# Altium project Main Board.PrjPcb
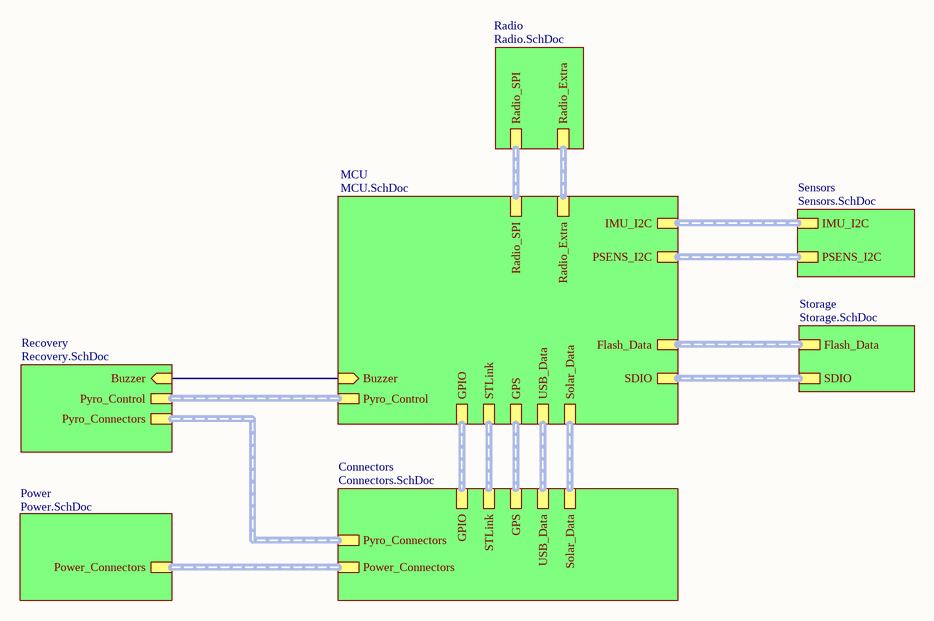
[diagram p0: Board Overview.SchDoc]
10 sheets, 127 parts. Net scope: hierarchical (ports join the sheet entries above them; power ports are global).
Board file: Main.PcbDoc
Sheets:
  Board Overview.SchDoc
    Power = Power.SchDoc
    MCU = MCU.SchDoc
    Storage = Storage.SchDoc
    Connectors = Connectors.SchDoc
    Radio = Radio.SchDoc
    Sensors = Sensors.SchDoc
    Recovery = Recovery.SchDoc
      P1 = Pyro.SchDoc
      P2 = Pyro.SchDoc
      Pyro Power = Pyro_Power.SchDoc

## Sheet Board Overview.SchDoc
size A4; SheetNumber: 1; SheetTotal: 10

### Sub-sheets
Connectors = Connectors.SchDoc: USB_Data (harness USB_Data), Pyro_Connectors (harness Pyro_Connectors), GPS (harness GPS), Power_Connectors (harness Power_Connectors), Solar_Data (harness Solar_Data), STLink (harness STLink), GPIO (harness GPIO)
MCU = MCU.SchDoc: USB_Data (harness USB_Data), Flash_Data (harness Flash_Data), SDIO (harness SDIO), PSENS_I2C (harness PSENS_I2C), IMU_I2C (harness IMU_I2C), Radio_SPI (harness Radio_SPI), Radio_Extra (harness Radio_extra), Pyro_Control (harness Pyro_Control), GPS (harness GPS), Buzzer (in), Solar_Data (harness Solar_Data), STLink (harness STLink), GPIO (harness GPIO)
Power = Power.SchDoc: Power_Connectors (harness Power_Connectors)
Radio = Radio.SchDoc: Radio_SPI (harness Radio_SPI), Radio_Extra (harness Radio_extra)
Recovery = Recovery.SchDoc: Pyro_Connectors (harness Pyro_Connectors), Pyro_Control (harness Pyro_Control), Buzzer (in)
Sensors = Sensors.SchDoc: IMU_I2C (harness IMU_I2C), PSENS_I2C (harness PSENS_I2C)
Storage = Storage.SchDoc: Flash_Data (harness Flash_Data), SDIO (harness SDIO)

### Nets
Buzzer: sheet MCU/Buzzer, sheet Recovery/Buzzer

### Buses and harness runs
harness sheet Connectors/GPIO = sheet MCU/GPIO
harness sheet Connectors/GPS = sheet MCU/GPS
harness sheet Connectors/Power_Connectors = sheet Power/Power_Connectors
harness sheet Connectors/Pyro_Connectors = sheet Recovery/Pyro_Connectors
harness sheet Connectors/Solar_Data = sheet MCU/Solar_Data
harness sheet Connectors/STLink = sheet MCU/STLink
harness sheet Connectors/USB_Data = sheet MCU/USB_Data
harness sheet MCU/Flash_Data = sheet Storage/Flash_Data
harness sheet MCU/IMU_I2C = sheet Sensors/IMU_I2C
harness sheet MCU/PSENS_I2C = sheet Sensors/PSENS_I2C
harness sheet MCU/Pyro_Control = sheet Recovery/Pyro_Control
harness sheet MCU/Radio_Extra = sheet Radio/Radio_Extra
harness sheet MCU/Radio_SPI = sheet Radio/Radio_SPI
harness sheet MCU/SDIO = sheet Storage/SDIO

## Sheet Power.SchDoc
size A4; SheetNumber: 6; SheetTotal: 10
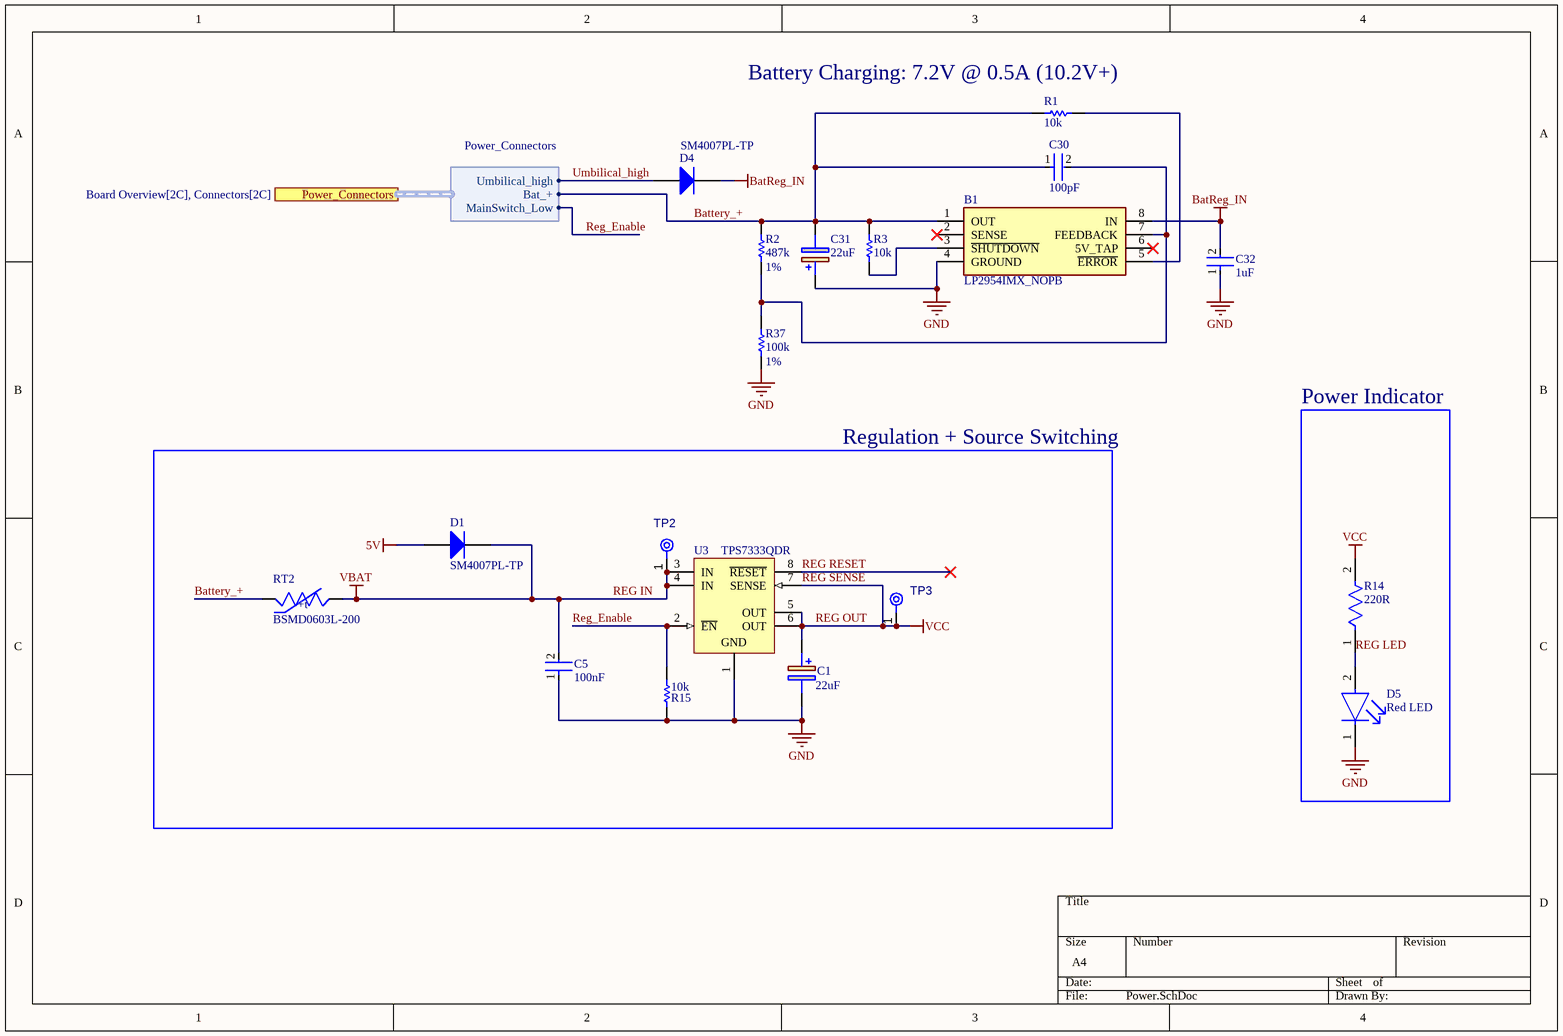
[diagram p1: Power.SchDoc]

### Parts
B1  LP2954IMX_NOPB  [SOIC127P600X175-8N]
C1  Capacitance: 22uF  [CAPPM3528X210N]  (hidden comment: TPSB226K010R0500)
C5  value 100nF  [FP-0603-L_1_6_0_15-W_0_81-IPC_C]  (hidden comment: Generic-Capacitor)
C30  value 100pF  [FP-0603-L_1_6_0_15-W_0_81-IPC_C]  (hidden comment: Generic-Capacitor)
C31  Capacitance: 22uF  [CAPPM3528X210N]  (hidden comment: TPSB226K010R0500)
C32  value 1uF  [FP-0603-L_1_6_0_15-W_0_81-IPC_C]  (hidden comment: Generic-Capacitor)
D1  SM4007PL-TP  [MCC-SOD-123FL_V]
D4  SM4007PL-TP  [MCC-SOD-123FL_V]
D5  Red LED  [FP-LTST-C190GKT-MFG]
R1  value 10k  [RESC1609X50X30ML8T20]  (hidden comment: Generic-Resistor)
R2  value 487k  Tolerance: 1%  [RESC1609X50X30ML8T20]  (hidden comment: Generic-Resistor)
R3  value 10k  [RESC1609X50X30ML8T20]  (hidden comment: Generic-Resistor)
R14  220R  [FP-CRCW0603-e3-IPC_C]
R15  10k  [RESC1608X55X25ML10T15]
R37  value 100k  Tolerance: 1%  [RESC1609X50X30ML8T20]  (hidden comment: Generic-Resistor)
RT2  BSMD0603L-200  [THRMC1608X95N]
TP2  TPAD6R  [TP06R]  (value not drawn)  (no BOM)
TP3  TPAD6R  [TP06R]  (value not drawn)  (no BOM)
U3  TPS7333QDR  [D0008A_L]

### Blocks framed on the sheet
Power Indicator: D5 R14
Regulation + Source Switching: C1 C5 D1 R15 RT2 TP2 TP3 U3

### Ports
Power_Connectors (harness Power_Connectors, see Board Overview[2C], Connectors[2C])

### Harnesses
Power_Connectors: Bat_+, MainSwitch_Low, Umbilical_high

### Nets
5V: D1.1(A)
BatReg_IN: B1.8(IN) C32.2 D4.2(K)
GND: B1.4(GROUND) C1.2(-) C5.1 C31.1(+) C32.1 D5.1(C) R15.1 R37.2 U3.1(GND)
VBAT: C5.2 D1.2(K) RT2.2 TP2.1(TP) U3.3(IN) U3.4(IN)  [also labelled REG IN]
VCC: C1.1(+) R14.2 TP3.1(TP) U3.5(OUT) U3.6(OUT) U3.7(SENSE)  [also labelled REG OUT, REG SENSE]
Battery_+: B1.1(OUT) C30.1 C31.2(-) R1.1 R2.1 R3.2 RT2.1 ; port Power_Connectors.Bat_+  [project net Bat_+]
REG LED: D5.2(A) R14.1
REG RESET: U3.8(~{RESET})
Reg_Enable: R15.2 U3.2(~{EN}) ; port Power_Connectors.MainSwitch_Low  [project net MainSwitch_Low]
Umbilical_high: D4.1(A) ; port Power_Connectors.Umbilical_high
NetB1_3: B1.3(~{SHUTDOWN}) R3.1
NetB1_5: B1.5(~{ERROR}) R1.2
NetB1_7: B1.7(FEEDBACK) C30.2 R2.2 R37.1

Not connected (* = marked no-connect by the designer): B1 2(SENSE)* 6(5V_TAP)*

### Notes on the sheet
- (near R1) Battery Charging: 7.2V @ 0.5A (10.2V+)
- (in symbol CMP-038-000000-2) +t

### Library data of the parts
B1 = CMP-086-000000-1: 5V and Adjustable Micropower LDOs; Manufacturer_Part_Number: LP2954IMX/NOPB; Manufacturer_Name: Texas Instruments; Geometry.Height: 1.75mm; Mouser Part Number: 926-LP2954IMX/NOPB; Mouser Price/Stock: https://www.mouser.co.uk/ProductDetail/Texas-Instruments/LP2954IMX-NOPB?qs=7lkVKPoqpbZZvpkFdRlvsg%3D%3D; Design Item ID: LP2954IMX_NOPB; Datasheet Link: http://www.ti.com/lit/gpn/LP2954; Source: LP2954IMX_NOPB.SchLib; LCSC Part #: C7989
C1 C31 = CMP-054-000000-2: AVX Electrolytic Capacitor 22uF 10V dc Electrolytic Solid +/-10% Tolerance TPS Series; Geometry.Height: 2.1mm; Manufacturer_Name: AVX; Manufacturer_Part_Number: TPSB226K010R0500; LCSC Part #: C400102; Mouser Part Number: 581-TPSB226K010R0500; Source: TPSB226K010R0500.SchLib; Design Item ID: TPSB226K010R0500; Datasheet Link: https://componentsearchengine.com/Datasheets/1/TPSB226K010R0500.pdf; Mouser Price/Stock: https://www.mouser.com/Search/Refine.aspx?Keyword=581-TPSB226K010R0500
C5 C30 C32 = CMP-001-00088-6: Generic 0603 Capacitor; Dielectric: X7R; Voltage Rating: 50V; Tolerance: 10%; ESR: 0R; Case Code (Imperial): 0603
  C5: LCSC Part #: C14663
  C30: LCSC Part #: C14858
  C32: LCSC Part #: C15849
D1 D4 = CMP-004-00034-1: DIODE GEN PURP 1KV 1A SOD123FL; LCSC Part #: C64898
D5 = CMP-00026-00001-1: SZYY0603R; LCSC PART #: C434419
R1 R3 = CMP-009-00185-4: Generic 0603 Resistor; Power Rating: 100mW; Voltage Rating: 75V; Tolerance: 0%; Case Code (Metric): 1608; Case Code (Imperial): 0603; LCSC Part #: C25804
R2 R37 = CMP-009-00185-4: Generic 0603 Resistor; Power Rating: 100mW; Voltage Rating: 75V; Case Code (Metric): 1608; Case Code (Imperial): 0603
  R2: LCSC Part #: C2930107
  R37: LCSC Part #: C25803
R14 = 0603WAF220JT5E-2: Res Thick Film 0603 220 Ohm 1% 1/10W ±100ppm/°C Molded SMD SMD Paper T/R; Power Rating: 100mW; Voltage Rating: 75V; Resistance: 220R; Resistance Tolerance: 1%; LCSC Part #: C22962
R15 = CMP-009-00177-3: ±1% 1/10W Thick Film Resistors 75V ±100ppm/℃ -55℃~+155℃ 10kΩ 0603 Chip Resistor - Surface Mount ROHS; LCSC Part #: C25804; Value: 10k
RT2 = CMP-038-000000-2: PTC Resettable Fuse: 2A Hold, 4A Trip, 0603; Hold Current: 2A; Pin Count: 2; Component Type: Standard; Availability: Unavailable; MP: BSMD0603L-200; Package: 0603; Design Item ID: BSMD0603L-200; Trip Current: 4A; LCSC Part #: C2757930
TP2 TP3 = CMP-00028-00002-2: 0.6mm round; Pins: 1
U3 = CMP-019-00052-1: IC REG LDO 3.3V 0.5A 8SOIC; LCSC Part #: C23791

## Sheet MCU.SchDoc
size A3; SheetNumber: 7; SheetTotal: 10
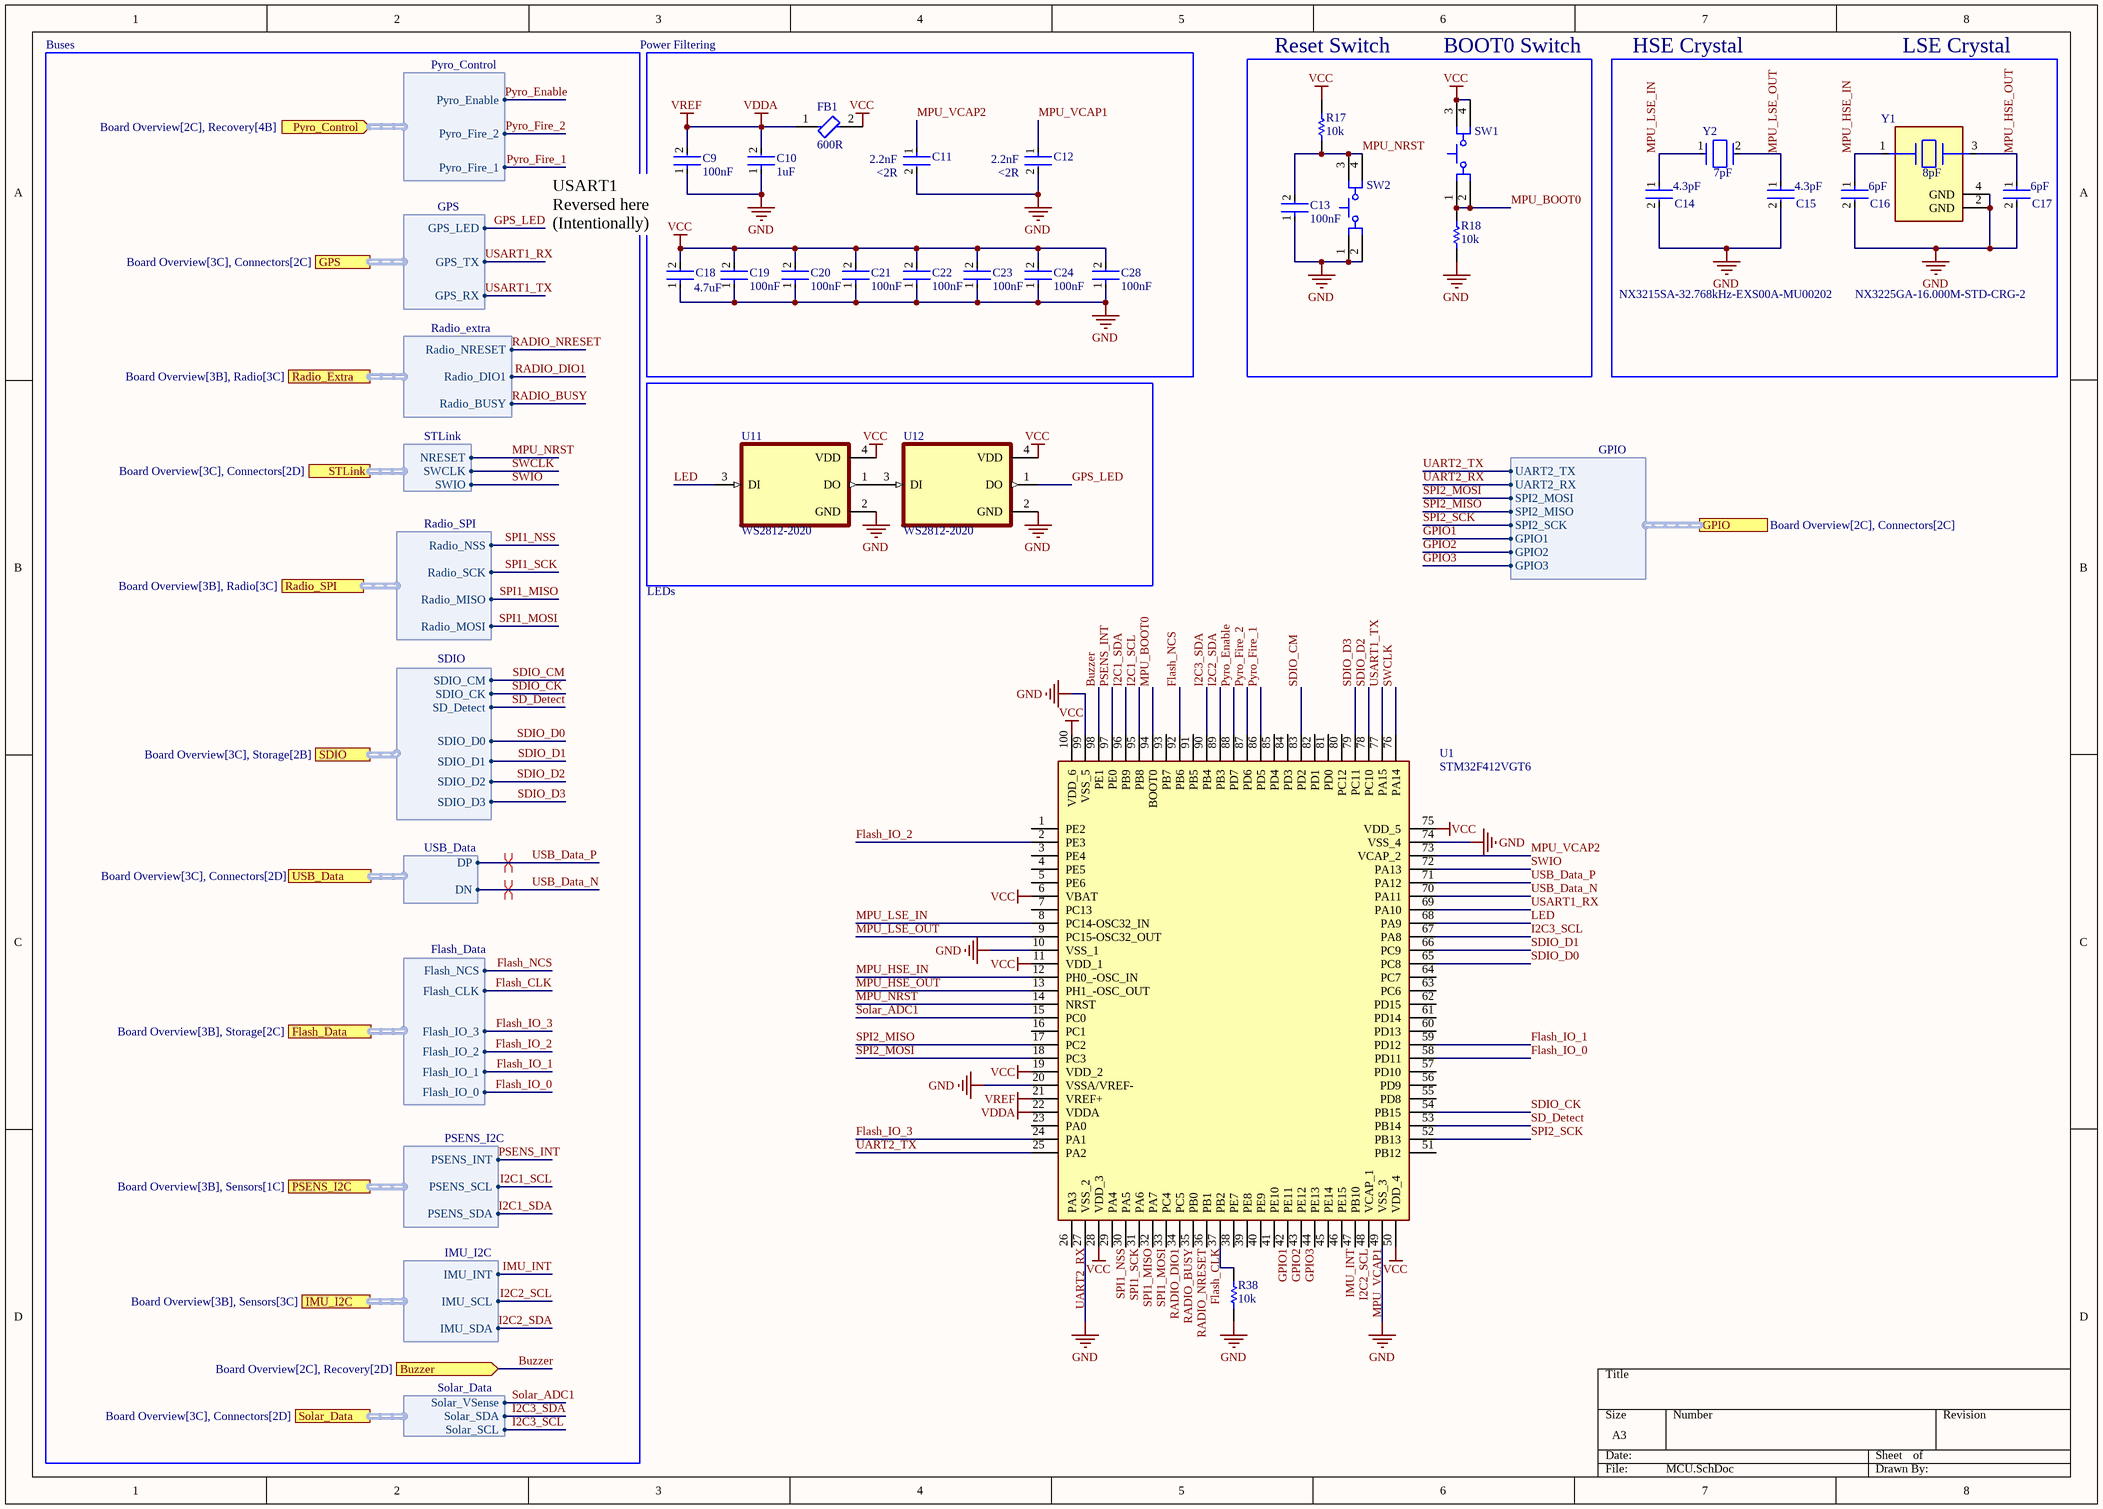
[diagram p2: MCU.SchDoc]

### Parts
C9  value 100nF  [FP-0603-L_1_6_0_15-W_0_81-IPC_C]  (hidden comment: Generic-Capacitor)
C10  value 1uF  [FP-0603-L_1_6_0_15-W_0_81-IPC_C]  (hidden comment: Generic-Capacitor)
C11  value 2.2nF  ESR: <2R  [FP-0603-L_1_6_0_15-W_0_81-IPC_C]  (hidden comment: Generic-Capacitor)
C12  value 2.2nF  ESR: <2R  [FP-0603-L_1_6_0_15-W_0_81-IPC_C]  (hidden comment: Generic-Capacitor)
C13  value 100nF  [FP-0603-L_1_6_0_15-W_0_81-IPC_C]  (hidden comment: Generic-Capacitor)
C14  value 4.3pF  [FP-CL10-IPC_B]  (hidden comment: 0603CG4R3C500NT)
C15  value 4.3pF  [FP-CL10-IPC_B]  (hidden comment: 0603CG4R3C500NT)
C16  value 6pF  [FP-CL10-IPC_B]  (hidden comment: CL10C060DB8NNNC)
C17  value 6pF  [FP-CL10-IPC_B]  (hidden comment: CL10C060DB8NNNC)
C18  value 4.7uF  [FP-0603-L_1_6_0_15-W_0_81-IPC_C]  (hidden comment: Generic-Capacitor)
C19  value 100nF  [FP-0603-L_1_6_0_15-W_0_81-IPC_C]  (hidden comment: Generic-Capacitor)
C20  value 100nF  [FP-0603-L_1_6_0_15-W_0_81-IPC_C]  (hidden comment: Generic-Capacitor)
C21  value 100nF  [FP-0603-L_1_6_0_15-W_0_81-IPC_C]  (hidden comment: Generic-Capacitor)
C22  value 100nF  [FP-0603-L_1_6_0_15-W_0_81-IPC_C]  (hidden comment: Generic-Capacitor)
C23  value 100nF  [FP-0603-L_1_6_0_15-W_0_81-IPC_C]  (hidden comment: Generic-Capacitor)
C24  value 100nF  [FP-0603-L_1_6_0_15-W_0_81-IPC_C]  (hidden comment: Generic-Capacitor)
C28  value 100nF  [FP-0603-L_1_6_0_15-W_0_81-IPC_C]  (hidden comment: Generic-Capacitor)
FB1  value 600R  [FP-BLM18-0_15-0_1-t0_6-IPC_B]  (hidden comment: GZ1608D601TF)
R17  value 10k  [RESC1608X55X25ML10T15]  (hidden comment: 0603WAF1002T5E)
R18  value 10k  [RESC1608X55X25ML10T15]  (hidden comment: 0603WAF1002T5E)
R38  value 10k  [RESC1609X50X30ML8T20]  (hidden comment: Generic-Resistor)
SW1  PTS645SM43SMTR92LFS  [CKCP-PTS645S_V]  (value not drawn)
SW2  PTS645SM43SMTR92LFS  [CKCP-PTS645S_V]  (value not drawn)
U1  STM32F412VGT6  [QFP50P1600X1600X160-100N]
U11  WS2812-2020  [LED_WS2812-2020]
U12  WS2812-2020  [LED_WS2812-2020]
Y1  NX3225GA-16.000M-STD-CRG-2  value 8pF  [FP-NX3225GA-MFG]
Y2  NX3215SA-32.768kHz-EXS00A-MU00202  value 7pF  [FP-NX3215SA-MFG]

### Ports
Buzzer (in, see Board Overview[2C], Recovery[2D]), Flash_Data (harness Flash_Data, see Board Overview[3B], Storage[2C]), GPIO (harness GPIO, see Board Overview[2C], Connectors[2C]), GPS (harness GPS, see Board Overview[3C], Connectors[2C]), IMU_I2C (harness IMU_I2C, see Board Overview[3B], Sensors[3C]), PSENS_I2C (harness PSENS_I2C, see Board Overview[3B], Sensors[1C]), Pyro_Control (in, harness Pyro_Control, see Board Overview[2C], Recovery[4B]), Radio_Extra (harness Radio_extra, see Board Overview[3B], Radio[3C]), Radio_SPI (harness Radio_SPI, see Board Overview[3B], Radio[3C]), SDIO (harness SDIO, see Board Overview[3C], Storage[2B]), Solar_Data (harness Solar_Data, see Board Overview[3C], Connectors[2D]), STLink (harness STLink, see Board Overview[3C], Connectors[2D]), USB_Data (harness USB_Data, see Board Overview[3C], Connectors[2D])

### Harnesses
USB_Data: DN, DP
Flash_Data: Flash_CLK, Flash_IO_0, Flash_IO_1, Flash_IO_2, Flash_IO_3, Flash_NCS
PSENS_I2C: PSENS_INT, PSENS_SCL, PSENS_SDA
IMU_I2C: IMU_INT, IMU_SCL, IMU_SDA
Radio_SPI: Radio_MOSI, Radio_MISO, Radio_SCK, Radio_NSS
Radio_extra: Radio_BUSY, Radio_DIO1, Radio_NRESET
Pyro_Control: Pyro_Fire_1, Pyro_Enable, Pyro_Fire_2
GPS: GPS_RX, GPS_TX, GPS_LED
SDIO: SDIO_CK, SDIO_CM, SDIO_D0, SDIO_D1, SDIO_D2, SDIO_D3, SD_Detect
Solar_Data: Solar_SCL, Solar_SDA, Solar_VSense
STLink: SWIO, SWCLK, NRESET
GPIO: UART2_TX, UART2_RX, SPI2_MOSI, SPI2_MISO, SPI2_SCK, GPIO1, GPIO2, GPIO3

### Nets
GND: C9.1 C10.1 C11.2 C12.2 C13.1 C14.2 C15.2 C16.2 C17.2 C18.1 C19.1 C20.1 C21.1 C22.1 C23.1 C24.1 C28.1 R18.1 R38.1 SW2.1 SW2.2 U1.10(VSS_1) U1.20(VSSA/VREF-) U1.27(VSS_2) U1.49(VSS_3) U1.74(VSS_4) U1.99(VSS_5) U11.2(GND) U12.2(GND) Y1.2(GND) Y1.4(GND)
VCC: C18.2 C19.2 C20.2 C21.2 C22.2 C23.2 C24.2 C28.2 FB1.2 R17.2 SW1.3 SW1.4 U1.6(VBAT) U1.11(VDD_1) U1.19(VDD_2) U1.28(VDD_3) U1.50(VDD_4) U1.75(VDD_5) U1.100(VDD_6) U11.4(VDD) U12.4(VDD)
VDDA: C9.2 C10.2 FB1.1 U1.21(VREF+) U1.22(VDDA)  [also labelled VREF]
Buzzer: U1.98(PE1) ; port Buzzer
Flash_CLK: U1.36(PB1) ; port Flash_Data.Flash_CLK  [project net Flash CLK]
Flash_IO_0: U1.58(PD11) ; port Flash_Data.Flash_IO_0  [project net Flash IO 0]
Flash_IO_1: U1.59(PD12) ; port Flash_Data.Flash_IO_1  [project net Flash IO 1]
Flash_IO_2: U1.2(PE3) ; port Flash_Data.Flash_IO_2  [project net Flash IO 2]
Flash_IO_3: U1.24(PA1) ; port Flash_Data.Flash_IO_3  [project net Flash IO 3]
Flash_NCS: U1.92(PB6) ; port Flash_Data.Flash_NCS  [project net Flash NCS]
GPIO1: U1.41(PE10) ; port GPIO.GPIO1
GPIO2: U1.42(PE11) ; port GPIO.GPIO2
GPIO3: U1.43(PE12) ; port GPIO.GPIO3
GPS_LED: U12.1(DO) ; port GPS.GPS_LED
I2C1_SCL: U1.95(PB8) ; port PSENS_I2C.PSENS_SCL
I2C1_SDA: U1.96(PB9) ; port PSENS_I2C.PSENS_SDA
I2C2_SCL: U1.47(PB10) ; port IMU_I2C.IMU_SCL
I2C2_SDA: U1.89(PB3) ; port IMU_I2C.IMU_SDA
I2C3_SCL: U1.67(PA8) ; port Solar_Data.Solar_SCL
I2C3_SDA: U1.90(PB4) ; port Solar_Data.Solar_SDA
IMU_INT: U1.46(PE15) ; port IMU_I2C.IMU_INT
LED: U1.68(PA9) U11.3(DI)
MPU_BOOT0: R18.2 SW1.1 SW1.2 U1.94(BOOT0)
MPU_HSE_IN: C16.1 U1.12(PH0_-OSC_IN) Y1.1
MPU_HSE_OUT: C17.1 U1.13(PH1_-OSC_OUT) Y1.3
MPU_LSE_IN: C14.1 U1.8(PC14-OSC32_IN) Y2.1
MPU_LSE_OUT: C15.1 U1.9(PC15-OSC32_OUT) Y2.2
MPU_NRST: C13.2 R17.1 SW2.3 SW2.4 U1.14(NRST) ; port STLink.NRESET
MPU_VCAP1: C12.1 U1.48(VCAP_1)
MPU_VCAP2: C11.1 U1.73(VCAP_2)
PSENS_INT: U1.97(PE0) ; port PSENS_I2C.PSENS_INT
Pyro_Enable: U1.88(PD7) ; port Pyro_Control.Pyro_Enable
Pyro_Fire_1: U1.86(PD5) ; port Pyro_Control.Pyro_Fire_1
Pyro_Fire_2: U1.87(PD6) ; port Pyro_Control.Pyro_Fire_2
RADIO_BUSY: U1.34(PC5) ; port Radio_Extra.Radio_BUSY  [project net BUSY]
RADIO_DIO1: U1.33(PC4) ; port Radio_Extra.Radio_DIO1  [project net DIO1]
RADIO_NRESET: U1.35(PB0) ; port Radio_Extra.Radio_NRESET  [project net NRESET]
SD_Detect: U1.53(PB14) ; port SDIO.SD_Detect
SDIO_CK: U1.54(PB15) ; port SDIO.SDIO_CK
SDIO_CM: U1.83(PD2) ; port SDIO.SDIO_CM
SDIO_D0: U1.65(PC8) ; port SDIO.SDIO_D0
SDIO_D1: U1.66(PC9) ; port SDIO.SDIO_D1
SDIO_D2: U1.78(PC10) ; port SDIO.SDIO_D2
SDIO_D3: U1.79(PC11) ; port SDIO.SDIO_D3
Solar_ADC1: U1.15(PC0) ; port Solar_Data.Solar_VSense
SPI1_MISO: U1.31(PA6) ; port Radio_SPI.Radio_MISO  [project net MISO]
SPI1_MOSI: U1.32(PA7) ; port Radio_SPI.Radio_MOSI  [project net MOSI]
SPI1_NSS: U1.29(PA4) ; port Radio_SPI.Radio_NSS  [project net NSS]
SPI1_SCK: U1.30(PA5) ; port Radio_SPI.Radio_SCK  [project net SCK]
SPI2_MISO: U1.17(PC2) ; port GPIO.SPI2_MISO
SPI2_MOSI: U1.18(PC3) ; port GPIO.SPI2_MOSI
SPI2_SCK: U1.52(PB13) ; port GPIO.SPI2_SCK
SWCLK: U1.76(PA14) ; port STLink.SWCLK
SWIO: U1.72(PA13) ; port STLink.SWIO
UART2_RX: U1.26(PA3) ; port GPIO.UART2_RX
UART2_TX: U1.25(PA2) ; port GPIO.UART2_TX
USART1_RX: U1.69(PA10) ; port GPS.GPS_TX  [project net GPS_TX]
USART1_TX: U1.77(PA15) ; port GPS.GPS_RX  [project net GPS_RX]
USB_Data_N: U1.70(PA11) ; port USB_Data.DN
USB_Data_P: U1.71(PA12) ; port USB_Data.DP
NetR38_2: R38.2 U1.37(PB2)
NetU11_1: U11.1(DO) U12.3(DI)

Not connected (* = marked no-connect by the designer): U1 1(PE2) 3(PE4) 4(PE5) 5(PE6) 7(PC13) 16(PC1) 23(PA0) 38(PE7) 39(PE8) 40(PE9) 44(PE13) 45(PE14) 51(PB12) 55(PD8) 56(PD9) 57(PD10) 60(PD13) 61(PD14) 62(PD15) 63(PC6) 64(PC7) 80(PC12) 81(PD0) 82(PD1) 84(PD3) 85(PD4) 91(PB5) 93(PB7)

### Layout directives
differential pair: USB_Data_N, USB_Data_P

### Notes on the sheet
- Buses
- Power Filtering
- Reset Switch
- BOOT0 Switch
- HSE Crystal
- LSE Crystal
- USART1 Reversed here (Intentionally)
- LEDs

### Library data of the parts
C9 = CMP-001-00088-6: Generic 0603 Capacitor; Tolerance: 10%; Dielectric: X7R; ESR: 0R; Voltage Rating: 50V; Case Code (Imperial): 0603; LCSC Part #: C14663
C10 C13 C18-C24 C28 = CMP-001-00088-6: as C5 on sheet Power; Case Code (Imperial): 0603
  C10: LCSC Part #: C15849
  C13 C19-C24 C28: LCSC Part #: C14663
  C18: LCSC Part #: C53987
C11 C12 = CMP-001-00088-6: Generic 0603 Capacitor; Dielectric: X7R; Voltage Rating: 50V; Tolerance: 10%; LCSC Part #: C1604; Case Code (Imperial): 0603
C14 C15 = CMP-001-00086-2: 50V 4.3pF C0G ±0.25pF 0603 Multilayer Ceramic Capacitors MLCC - SMD/SMT ROHS; LCSC PART #: C59526
C16 C17 = CMP-001-00087-1: CAP CER 6PF 50V C0G/NP0 0603; LCSC PART #: C37474
FB1 = CMP-006-00021-1: 0603 600Ω ±25% DCR=0.45Ω 0.2A; LCSC PART #: C1002
R17 R18 = CMP-009-00177-3: as R15 on sheet Power; LCSC Part #: C25804
R38 = CMP-009-00185-4: Generic 0603 Resistor; Power Rating: 100mW; Tolerance: 0%; Voltage Rating: 75V; Case Code (Metric): 1608; Case Code (Imperial): 0603; LCSC Part #: C25804
SW1 SW2 = CMP-011-00016-1: Switch Tactile N.O. SPST Round Button Gull Wing 0.05A 12VDC 100000Cycles 1.57N SMD T/R; LCSC PART #: C221880
U1 = CMP-028-000000-1: STMICROELECTRONICS - STM32F412VGT6 - ARM MCU, STM32 Family STM32F4 Series Microcontrollers, ARM Cortex-M4F, 32bit, 100 MHz, 1 MB, 256 KB; Geometry.Height: 1.6mm; Manufacturer_Part_Number: STM32F412VGT6; Manufacturer_Name: STMicroelectronics; Mouser Price/Stock: https://www.mouser.co.uk/ProductDetail/STMicroelectronics/STM32F412VGT6/?qs=qzCNEk%252BRr%252BaGf9Ry5zWpvw%3D%3D; Design Item ID: STM32F412VGT6; Mouser Part Number: 511-STM32F412VGT6; Datasheet Link: https://4donline.ihs.com/images/VipMasterIC/IC/SGST/SGST-S-A0004202317/SGST-S-A0004202317-1.pdf?hkey=6D3A4C79FDBF58556ACFDE234799DDF0; Source: STM32F412VGT6.SchLib; Package: 100-LQFP; LCSC Part #: C727951
U11 U12 = CMP-002-000000-1: Intelligent control LED light source, SMD-4; MF: Worldsemi; Value: *; Pin Count: 4; Check_prices: https://www.snapeda.com/parts/WS2812-2020/Worldsemi/view-part/?ref=eda; Package: Package; SnapEDA_Link: https://www.snapeda.com/parts/WS2812-2020/Worldsemi/view-part/?ref=snap; Price: None; MP: WS2812-2020; Availability: Not in stock; Design Item ID: WS2812-2020; Source: WS2812-2020.SchLib; Component Type: Standard; LCSC Part #: C965555
Y1 = CMP-003-00030-1: Crystal 16MHz ±20ppm (Tol) ±30ppm (Stability) 8pF FUND 80Ohm Automotive 4-Pin SMD; LCSC PART #: C156247
Y2 = CMP-003-00031-1: Crystal 32.7680KHZ 7PF SMD; LCSC PART #: C280830

## Sheet Storage.SchDoc
size A4; SheetNumber: 8; SheetTotal: 10
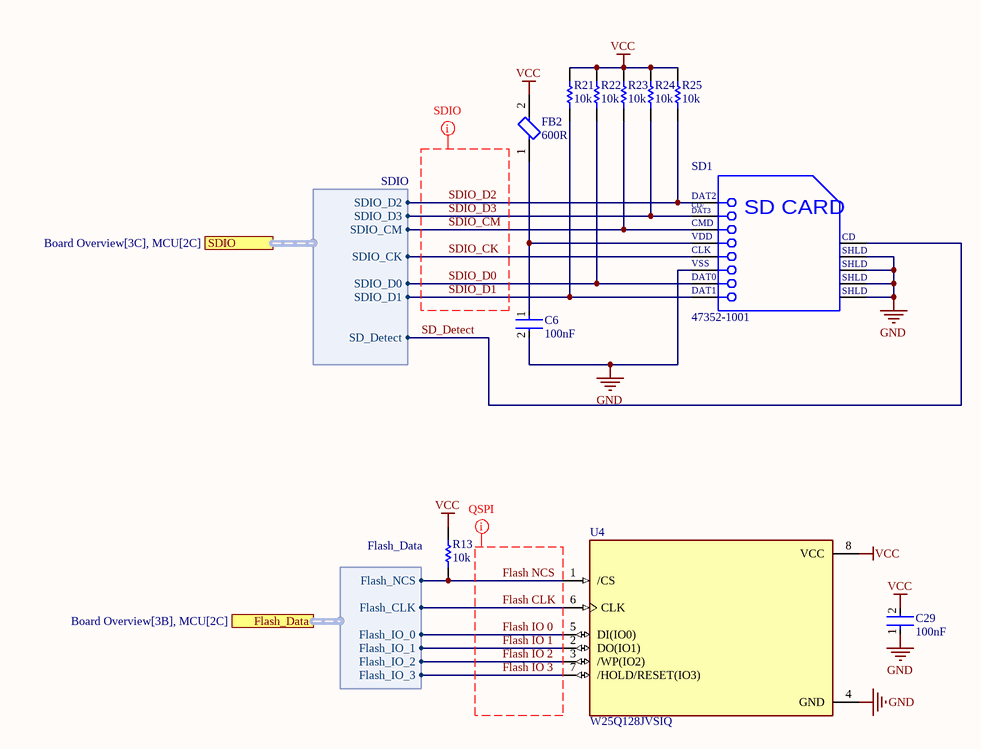
[diagram p3: Storage.SchDoc]

### Parts
C6  value 100nF  [FP-0603-L_1_6_0_15-W_0_81-IPC_C]  (hidden comment: Generic-Capacitor)
C29  value 100nF  [FP-0603-L_1_6_0_15-W_0_81-IPC_C]  (hidden comment: Generic-Capacitor)
FB2  value 600R  [FP-BLM18-0_15-0_1-t0_6-IPC_B]  (hidden comment: GZ1608D601TF)
R13  value 10k  [RESC1609X50X30ML8T20]  (hidden comment: Generic-Resistor)
R21  value 10k  [RESC1609X50X30ML8T20]  (hidden comment: Generic-Resistor)
R22  value 10k  [RESC1609X50X30ML8T20]  (hidden comment: Generic-Resistor)
R23  value 10k  [RESC1609X50X30ML8T20]  (hidden comment: Generic-Resistor)
R24  value 10k  [RESC1609X50X30ML8T20]  (hidden comment: Generic-Resistor)
R25  value 10k  [RESC1609X50X30ML8T20]  (hidden comment: Generic-Resistor)
SD1  47352-1001  [MOLX-473521001_V]
U4  W25Q128JVSIQ  [SOIC127P790X216-8N]

### Ports
Flash_Data (harness Flash_Data, see Board Overview[3B], MCU[2C]), SDIO (harness SDIO, see Board Overview[3C], MCU[2C])

### Harnesses
Flash_Data: Flash_NCS, Flash_CLK, Flash_IO_0, Flash_IO_1, Flash_IO_2, Flash_IO_3
SDIO: SDIO_D2, SDIO_D3, SDIO_CM, SDIO_CK, SDIO_D0, SDIO_D1, SD_Detect

### Nets
GND: C6.2 C29.1 SD1.6(VSS) SD1.10(SHLD) SD1.11(SHLD) SD1.12(SHLD) SD1.13(SHLD) U4.4(GND)
VCC: C29.2 FB2.2 R13.2 R21.2 R22.2 R23.2 R24.2 R25.2 U4.8(VCC)
Flash CLK: U4.6(CLK) ; port Flash_Data.Flash_CLK
Flash IO 0: U4.5(DI(IO0)) ; port Flash_Data.Flash_IO_0
Flash IO 1: U4.2(DO(IO1)) ; port Flash_Data.Flash_IO_1
Flash IO 2: U4.3(/WP(IO2)) ; port Flash_Data.Flash_IO_2
Flash IO 3: U4.7(/HOLD/RESET(IO3)) ; port Flash_Data.Flash_IO_3
Flash NCS: R13.1 U4.1(/CS) ; port Flash_Data.Flash_NCS
SD_Detect: SD1.9(CD) ; port SDIO.SD_Detect
SDIO_CK: SD1.5(CLK) ; port SDIO.SDIO_CK
SDIO_CM: R23.1 SD1.3(CMD) ; port SDIO.SDIO_CM
SDIO_D0: R22.1 SD1.7(DAT0) ; port SDIO.SDIO_D0
SDIO_D1: R21.1 SD1.8(DAT1) ; port SDIO.SDIO_D1
SDIO_D2: R25.1 SD1.1(DAT2) ; port SDIO.SDIO_D2
SDIO_D3: R24.1 SD1.2(CD/DAT3) ; port SDIO.SDIO_D3
NetC6_1: C6.1 FB2.1 SD1.4(VDD)

### Layout directives
mark named QSPI: Flash CLK, Flash IO 0, Flash IO 1, Flash IO 2, Flash IO 3, Flash NCS
mark named SDIO: SDIO_CK, SDIO_CM, SDIO_D0, SDIO_D1, SDIO_D2, SDIO_D3

### Notes on the sheet
- (in symbol CMP-002-00077-1) CD/; DAT3; SD CARD

### Library data of the parts
C6 C29 = CMP-001-00088-6: as C5 on sheet Power; LCSC Part #: C14663; Case Code (Imperial): 0603
FB2 = CMP-006-00021-1: 0603 600Ω ±25% DCR=0.45Ω 0.2A; LCSC PART #: C1002
R13 R21-R25 = CMP-009-00185-4: as R38 on sheet MCU; Case Code (Metric): 1608; Case Code (Imperial): 0603; LCSC Part #: C25804
SD1 = CMP-002-00077-1: Conn Micro SD Card HDR 8 POS 1.1mm Solder RA SMD Embossed T/R 0.5A/Contact; LCSC Part #: C293569
U4 = CMP-040-000000-2: FLASH - NOR Memory IC 128Mb (16M x 8) SPI - Quad I/O, QPI, DTR 133 MHz 8-SOIC; MF: Winbond Electronics; Capacity: 128Mb; Design Item ID: W25Q128JVSIQ; Pin Count: 8; MP: W25Q128JVSIQ; Price: None; Package: SOIC-8 Winbond; LCSC Part #: C97521

## Sheet Connectors.SchDoc
size A4; SheetNumber: 9; SheetTotal: 10
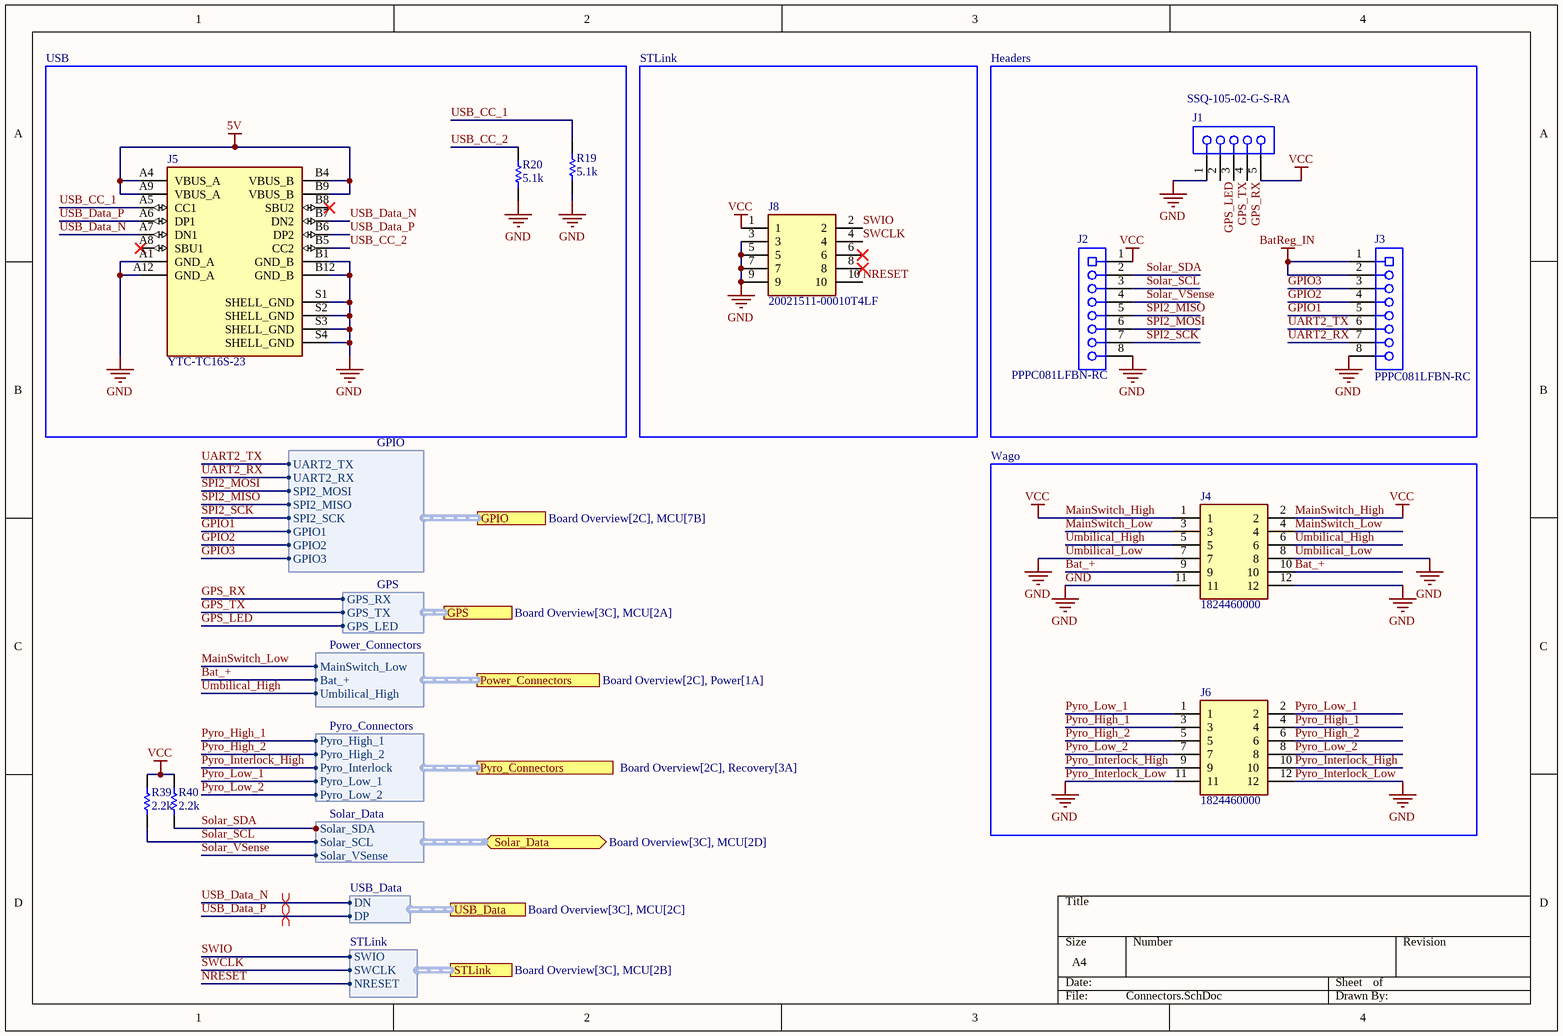
[diagram p4: Connectors.SchDoc]

### Parts
J1  SSQ-105-02-G-S-RA  [SMTC-SSQ-105-02-X-S-RA]
J2  PPPC081LFBN-RC  [SLIN-PPPC081LFBN-RC_V]
J3  PPPC081LFBN-RC  [SLIN-PPPC081LFBN-RC_V]
J4  1824460000  [SHDR12W80P700X350_2X6_2170X1400X850P]
J5  YTC-TC16S-23  [VALCON_CSP-USC16-TR]
J6  1824460000  [SHDR12W80P700X350_2X6_2170X1400X850P]
J8  20021511-00010T4LF  [2002151100010T4LF]
R19  value 5.1k  [RESC1609X50X30ML8T20]  (hidden comment: Generic-Resistor)
R20  value 5.1k  [RESC1609X50X30ML8T20]  (hidden comment: Generic-Resistor)
R39  value 2.2k  [RESC1609X50X30ML8T20]  (hidden comment: Generic-Resistor)
R40  value 2.2k  [RESC1609X50X30ML8T20]  (hidden comment: Generic-Resistor)

### Blocks framed on the sheet
USB: J5 R19 R20
STLink: J8
Headers: J1-J3
Wago: J4 J6

### Ports
GPIO (harness GPIO, see Board Overview[2C], MCU[7B]), GPS (harness GPS, see Board Overview[3C], MCU[2A]), Power_Connectors (harness Power_Connectors, see Board Overview[2C], Power[1A]), Pyro_Connectors (harness Pyro_Connectors, see Board Overview[2C], Recovery[3A]), Solar_Data (bidir, harness Solar_Data, see Board Overview[3C], MCU[2D]), STLink (harness STLink, see Board Overview[3C], MCU[2B]), USB_Data (harness USB_Data, see Board Overview[3C], MCU[2C])

### Harnesses
USB_Data: DP, DN
GPS: GPS_RX, GPS_TX, GPS_LED
Power_Connectors: Bat_+, MainSwitch_Low, Umbilical_High
Pyro_Connectors: Pyro_High_1, Pyro_High_2, Pyro_Interlock, Pyro_Low_1, Pyro_Low_2
Solar_Data: Solar_SCL, Solar_SDA, Solar_VSense
STLink: SWIO, SWCLK, NRESET
GPIO: UART2_TX, UART2_RX, SPI2_MOSI, SPI2_MISO, SPI2_SCK, GPIO1, GPIO2, GPIO3

### Nets
5V: J5.A4(VBUS_A) J5.A9(VBUS_A) J5.B4(VBUS_B) J5.B9(VBUS_B)
BatReg_IN: J3.1 J3.2
GND: J1.1 J2.8 J3.8 J4.7 J4.8 J4.11 J4.12 J5.A1(GND_A) J5.A12(GND_A) J5.B1(GND_B) J5.B12(GND_B) J5.S1(SHELL_GND) J5.S2(SHELL_GND) J5.S3(SHELL_GND) J5.S4(SHELL_GND) J6.11 J6.12 J8.3 J8.5 J8.7 J8.9 R19.2 R20.2  [also labelled Pyro_Interlock_Low, Umbilical_Low]
VCC: J1.5 J2.1 J4.1 J4.2 J8.1 R39.1 R40.1  [also labelled MainSwitch_High]
Bat_+: J4.9 J4.10 ; port Power_Connectors.Bat_+
GPIO1: J3.5 ; port GPIO.GPIO1
GPIO2: J3.4 ; port GPIO.GPIO2
GPIO3: J3.3 ; port GPIO.GPIO3
GPS_LED: J1.2 ; port GPS.GPS_LED
GPS_RX: J1.4 ; port GPS.GPS_RX
GPS_TX: J1.3 ; port GPS.GPS_TX
MainSwitch_Low: J4.3 J4.4 ; port Power_Connectors.MainSwitch_Low
NRESET: J8.10 ; port STLink.NRESET  [project net MPU_NRST]
Pyro_High_1: J6.3 J6.4 J6.5 J6.6 ; port Pyro_Connectors.Pyro_High_1, port Pyro_Connectors.Pyro_High_2  [also labelled Pyro_High_2]
Pyro_Interlock_High: J6.9 J6.10 ; port Pyro_Connectors.Pyro_Interlock
Pyro_Low_1: J6.1 J6.2 ; port Pyro_Connectors.Pyro_Low_1
Pyro_Low_2: J6.7 J6.8 ; port Pyro_Connectors.Pyro_Low_2
Solar_SCL: J2.3 R39.2 ; port Solar_Data.Solar_SCL  [project net I2C3_SCL]
Solar_SDA: J2.2 R40.2 ; port Solar_Data.Solar_SDA  [project net I2C3_SDA]
Solar_VSense: J2.4 ; port Solar_Data.Solar_VSense  [project net Solar_ADC1]
SPI2_MISO: J2.5 ; port GPIO.SPI2_MISO
SPI2_MOSI: J2.6 ; port GPIO.SPI2_MOSI
SPI2_SCK: J2.7 ; port GPIO.SPI2_SCK
SWCLK: J8.4 ; port STLink.SWCLK
SWIO: J8.2 ; port STLink.SWIO
UART2_RX: J3.7 ; port GPIO.UART2_RX
UART2_TX: J3.6 ; port GPIO.UART2_TX
Umbilical_high: J4.5 J4.6 ; port Power_Connectors.Umbilical_High
USB_CC_1: J5.A5(CC1) R19.1
USB_CC_2: J5.B5(CC2) R20.1
USB_Data_N: J5.A7(DN1) J5.B7(DN2) ; port USB_Data.DN
USB_Data_P: J5.A6(DP1) J5.B6(DP2) ; port USB_Data.DP

Not connected (* = marked no-connect by the designer): J5 A8(SBU1)* B8(SBU2)*; J8 6* 8*

### Layout directives
differential pair: USB_Data_N, USB_Data_P

### Library data of the parts
J1 = CMP-002-00078-1: Headers & Wire Housings Tiger Buy Socket Strip with Square Tails, 0.100 Pitch
J2 J3 = CMP-002-00028-2: Female Header, Pitch 2.54 mm, 1 x 8 Position, Height 8.5 mm, Tail Length 3.2 mm, -40 to 105 degC, RoHS, Bulk; Manufacturer: Sullins; Package Reference: PPPC081LFBN-RC; Connector Type: Header; Datasheet Version: Jan-15; Package Description: Female Header, Pitch 2.54 mm, 1 x 8 Position, Height 8.5 mm, Tail Length 3.2 mm; RoHS Compliant: Unknown; Max Operating Temperature: 105°C; Case/Package: PPPC081LFBN-RC; Min Operating Temperature: -40°C; Datasheet URL: http://sullinscorp.com/catalogs/101_PAGE114-115_.100_FEMALE_HDR.pdf; Gender: Female; Mounting Technology: TH
J4 J6 = CMP-062-000000-2: Printed circuit board terminals, 3.50 mm, Number of poles: 6, 90, Solder pin length: 3.5 mm, black, PUSH IN with actuator, Clamping range, max. [rated connection]: 1.5 mm, Tube; Manufacturer_Name: Weidmuller; Geometry.Height: 8.5mm; Mouser Price/Stock: https://www.mouser.co.uk/ProductDetail/Weidmuller/1824460000?qs=WJDKaGZ8K%252B6qGfZkM4Ritg%3D%3D; Design Item ID: 1824460000; Mouser Part Number: 470-1824460000; Datasheet Link: http://catalog.weidmueller.com/createDatasheetForMobile.do?ordernumber=1824460000&scope1=1&scope2=1&localeId=en; Source: 1824460000.SchLib; Manufacturer_Part_Number: 1824460000
J5 = CMP-042-000000-3: YTC-TC16S-23 USB Type C Surface Mount PCB Socket 3A; MP: CSP-USC16-TR; Pin Count: 20; Availability: In Stock; Design Item ID: CSP-USC16-TR; LCSC Part #: C2927300
J8 = CMP-003-000001-3: 1.27mm (0.05in.) pitch, Shrouded header, 10 contacts; Manufacturer_Name: Amphenol Communications Solutions; Geometry.Height: 5.65mm; Mouser Part Number: 649-221511-00010T4LF; Datasheet Link: https://cdn.amphenol-cs.com/media/wysiwyg/files/drawing/20021511.pdf; Mouser Price/Stock: https://www.mouser.co.uk/ProductDetail/Amphenol-FCI/20021511-00010T4LF?qs=oJs1R%252BxK6kSq16VF%2F5iyPQ%3D%3D; Design Item ID: 20021511-00010T4LF; Source: 20021511-00010T4LF.SchLib; Manufacturer_Part_Number: 20021511-00010T4LF
R19 R20 R39 R40 = CMP-009-00185-4: as R38 on sheet MCU; Case Code (Metric): 1608; Case Code (Imperial): 0603
  R19 R20: LCSC Part #: C23186
  R39 R40: LCSC Part #: C4190

## Sheet Radio.SchDoc
size A4; SheetNumber: 10; SheetTotal: 10
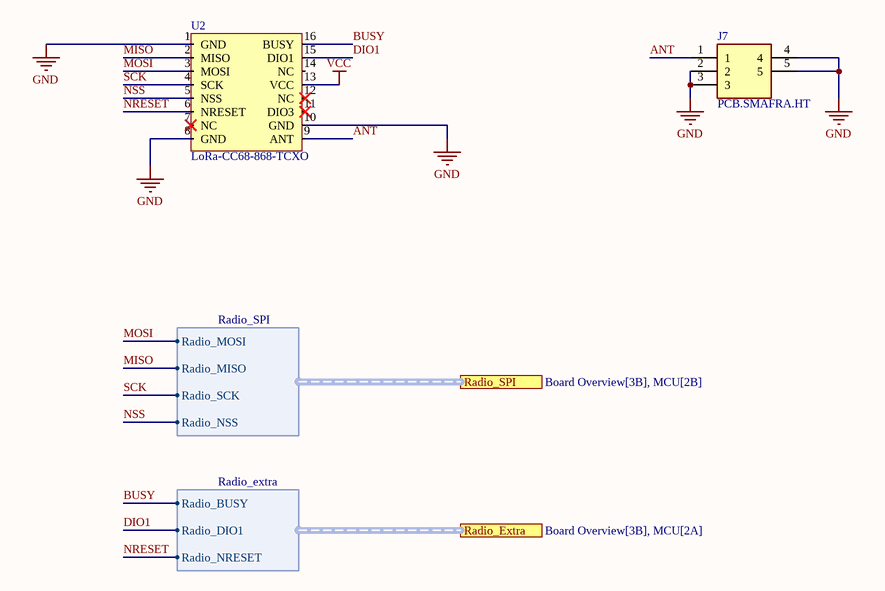
[diagram p5: Radio.SchDoc]

### Parts
J7  PCB.SMAFRA.HT  [PCBSMAFRAHT]
U2  LoRa-CC68-868-TCXO  [LoRa-CC68-868-TCXO-Footprint-1]

### Ports
Radio_Extra (harness Radio_extra, see Board Overview[3B], MCU[2A]), Radio_SPI (harness Radio_SPI, see Board Overview[3B], MCU[2B])

### Harnesses
Radio_SPI: Radio_MOSI, Radio_MISO, Radio_SCK, Radio_NSS
Radio_extra: Radio_BUSY, Radio_DIO1, Radio_NRESET

### Nets
GND: J7.2 J7.3 J7.4 J7.5 U2.1(GND) U2.8(GND) U2.10(GND)
VCC: U2.13(VCC)
ANT: J7.1 U2.9(ANT)
BUSY: U2.16(BUSY) ; port Radio_Extra.Radio_BUSY
DIO1: U2.15(DIO1) ; port Radio_Extra.Radio_DIO1
MISO: U2.2(MISO) ; port Radio_SPI.Radio_MISO
MOSI: U2.3(MOSI) ; port Radio_SPI.Radio_MOSI
NRESET: U2.6(NRESET) ; port Radio_Extra.Radio_NRESET
NSS: U2.5(NSS) ; port Radio_SPI.Radio_NSS
SCK: U2.4(SCK) ; port Radio_SPI.Radio_SCK

Not connected (* = marked no-connect by the designer): U2 7(NC)* 11(DIO3)* 12(NC)* 14(NC)

### Library data of the parts
J7 = CMP-070-000000-1: RF Connectors / Coaxial Connectors SMA RA PCB Mount, Jack, Gold, 50 , Through Hole Pin; Manufacturer_Name: Taoglas; Geometry.Height: 9mm; Manufacturer_Part_Number: PCB.SMAFRA.HT; Mouser Part Number: 960-PCB.SMAFRA.HT; Design Item ID: PCB.SMAFRA.HT; Datasheet Link: *; Mouser Price/Stock: https://www.mouser.co.uk/ProductDetail/Taoglas/PCB.SMAFRA.HT?qs=RuW%2Fu%252BNMQmubIFYcN8w5Dw%3D%3D; Source: PCB.SMAFRA.HT.SchLib
U2 = CMP-00025-00003-3: LoRa-CC68 targeting 868MHz and with a TXCO

## Sheet Sensors.SchDoc
size A4; SheetNumber: 2; SheetTotal: 10
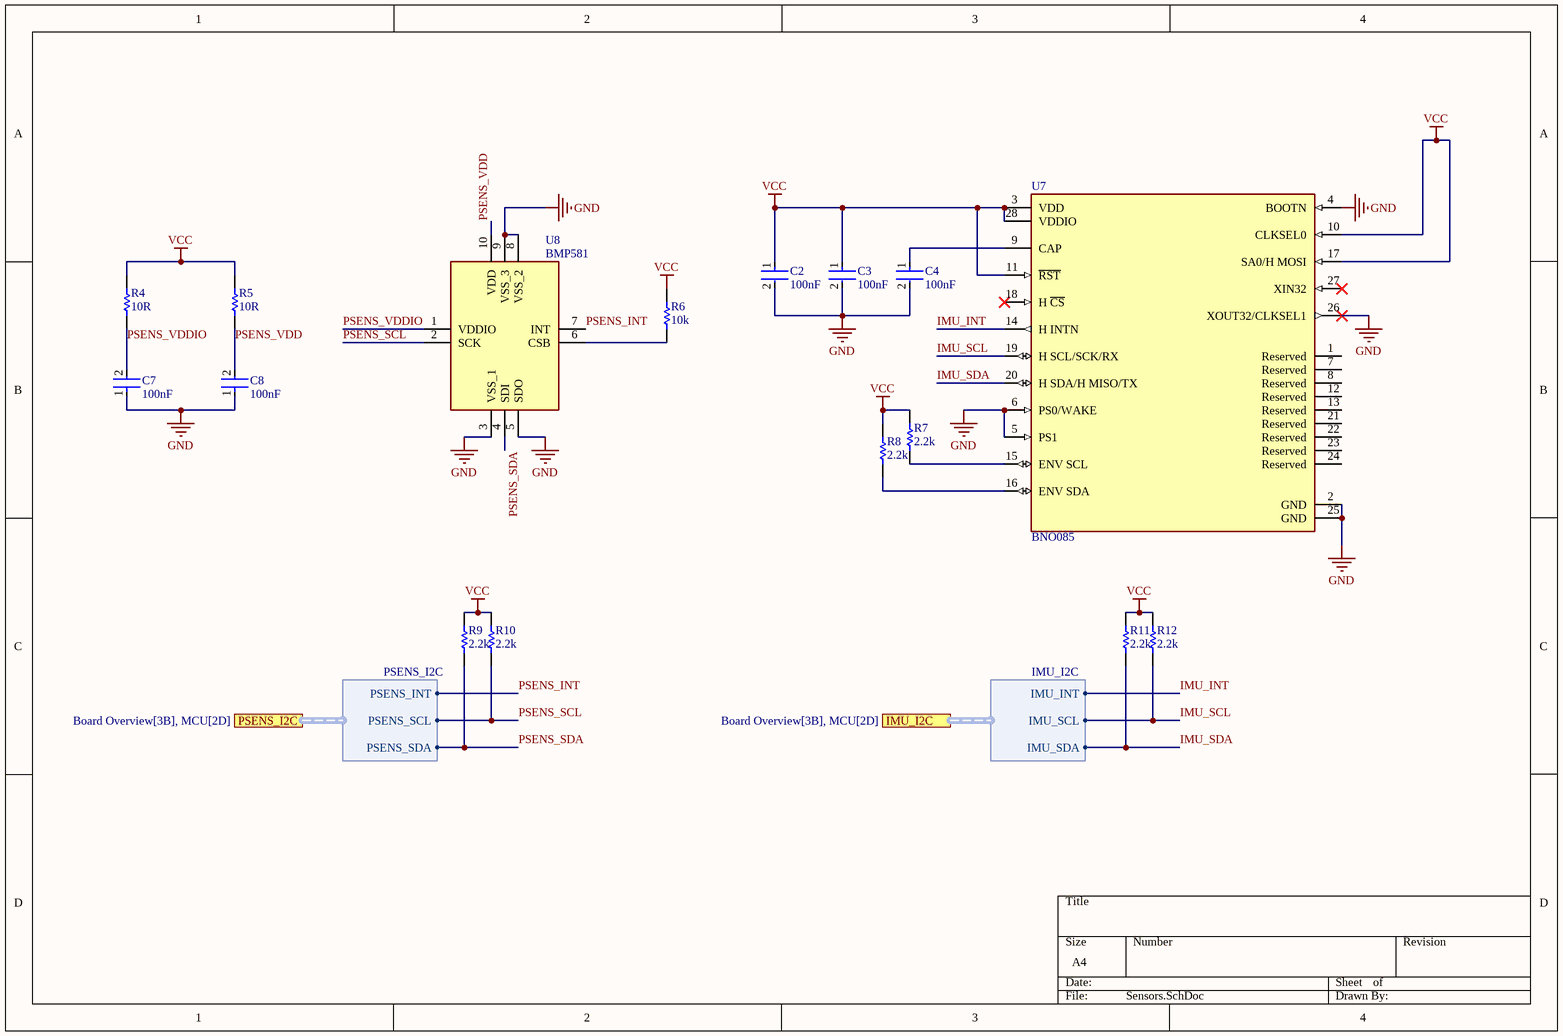
[diagram p6: Sensors.SchDoc]

### Parts
C2  value 100nF  [FP-0603-L_1_6_0_15-W_0_81-IPC_C]  (hidden comment: Generic-Capacitor)
C3  value 100nF  [FP-0603-L_1_6_0_15-W_0_81-IPC_C]  (hidden comment: Generic-Capacitor)
C4  value 100nF  [FP-0603-L_1_6_0_15-W_0_81-IPC_C]  (hidden comment: Generic-Capacitor)
C7  value 100nF  [FP-0603-L_1_6_0_15-W_0_81-IPC_C]  (hidden comment: Generic-Capacitor)
C8  value 100nF  [FP-0603-L_1_6_0_15-W_0_81-IPC_C]  (hidden comment: Generic-Capacitor)
R4  value 10R  [RESC1609X50X30ML8T20]  (hidden comment: Generic-Resistor)
R5  value 10R  [RESC1609X50X30ML8T20]  (hidden comment: Generic-Resistor)
R6  value 10k  [RESC1609X50X30ML8T20]  (hidden comment: Generic-Resistor)
R7  value 2.2k  [RESC1609X50X30ML8T20]  (hidden comment: Generic-Resistor)
R8  value 2.2k  [RESC1609X50X30ML8T20]  (hidden comment: Generic-Resistor)
R9  value 2.2k  [RESC1609X50X30ML8T20]  (hidden comment: Generic-Resistor)
R10  value 2.2k  [RESC1609X50X30ML8T20]  (hidden comment: Generic-Resistor)
R11  value 2.2k  [RESC1609X50X30ML8T20]  (hidden comment: Generic-Resistor)
R12  value 2.2k  [RESC1609X50X30ML8T20]  (hidden comment: Generic-Resistor)
U7  BNO085  [FP-BNO085-MFG]
U8  BMP581  [BMP581]

### Ports
IMU_I2C (harness IMU_I2C, see Board Overview[3B], MCU[2D]), PSENS_I2C (harness PSENS_I2C, see Board Overview[3B], MCU[2D])

### Harnesses
IMU_I2C: IMU_INT, IMU_SCL, IMU_SDA
PSENS_I2C: PSENS_INT, PSENS_SCL, PSENS_SDA

### Nets
GND: C2.2 C3.2 C4.2 C7.1 C8.1 U7.2(GND) U7.4(BOOTN) U7.5(PS1) U7.6(PS0/WAKE) U7.25(GND) U7.26(XOUT32/CLKSEL1) U8.3(VSS_1) U8.5(SDO) U8.8(VSS_2) U8.9(VSS_3)
VCC: C2.1 C3.1 R4.2 R5.2 R6.2 R7.1 R8.1 R9.1 R10.1 R11.1 R12.1 U7.3(VDD) U7.10(CLKSEL0) U7.11(~{RST}) U7.17(SA0/H_MOSI) U7.28(VDDIO)
IMU_INT: U7.14(H_INTN) ; port IMU_I2C.IMU_INT
IMU_SCL: R12.2 U7.19(H_SCL/SCK/RX) ; port IMU_I2C.IMU_SCL  [project net I2C2_SCL]
IMU_SDA: R11.2 U7.20(H_SDA/H_MISO/TX) ; port IMU_I2C.IMU_SDA  [project net I2C2_SDA]
PSENS_INT: U8.7(INT) ; port PSENS_I2C.PSENS_INT
PSENS_SCL: R10.2 U8.2(SCK) ; port PSENS_I2C.PSENS_SCL  [project net I2C1_SCL]
PSENS_SDA: R9.2 U8.4(SDI) ; port PSENS_I2C.PSENS_SDA  [project net I2C1_SDA]
PSENS_VDD: C8.2 R5.1 U8.10(VDD)
PSENS_VDDIO: C7.2 R4.1 U8.1(VDDIO)
NetC4_1: C4.1 U7.9(CAP)
NetR6_1: R6.1 U8.6(CSB)
NetR7_2: R7.2 U7.15(ENV_SCL)
NetR8_2: R8.2 U7.16(ENV_SDA)

Not connected (* = marked no-connect by the designer): U7 1(Reserved) 7(Reserved) 8(Reserved) 12(Reserved) 13(Reserved) 18(H_~{CS})* 21(Reserved) 22(Reserved) 23(Reserved) 24(Reserved) 27(XIN32)*

### Library data of the parts
C2-C4 = CMP-001-00088-6: as C5 on sheet Power; LCSC Part #: C14663; Case Code (Imperial): 0603
C7 C8 = CMP-001-00088-6: as C9 on sheet MCU; Case Code (Imperial): 0603; LCSC Part #: C14663
R4-R12 = CMP-009-00185-4: as R38 on sheet MCU; Case Code (Metric): 1608; Case Code (Imperial): 0603
  R4 R5: LCSC Part #: C22859
  R6: LCSC Part #: C25804
  R7-R12: LCSC Part #: C4190
U7 = CMP-010-00028-1: IMU Accel/gyro/mag I2C 32 Bit
U8 = CMP-048-000000-2: Pressure Sensor 4.35PSI ~ 18.13PSI (30kPa ~ 125kPa) Absolute 10-WFLGA; Manufacturer_Name: BOSCH; Geometry.Height: 0.8mm; Mouser Price/Stock: https://www.mouser.co.uk/ProductDetail/Bosch-Sensortec/BMP581?qs=Li%252BoUPsLEntPL9tlFmcgXg%3D%3D; Manufacturer_Part_Number: BMP581; Design Item ID: BMP581; Source: BMP581.SchLib; Datasheet Link: https://www.bosch-sensortec.com/media/boschsensortec/downloads/datasheets/bst-bmp581-ds004.pdf; Mouser Part Number: 262-BMP581

## Sheet Recovery.SchDoc
size A4; SheetNumber: 3; SheetTotal: 10
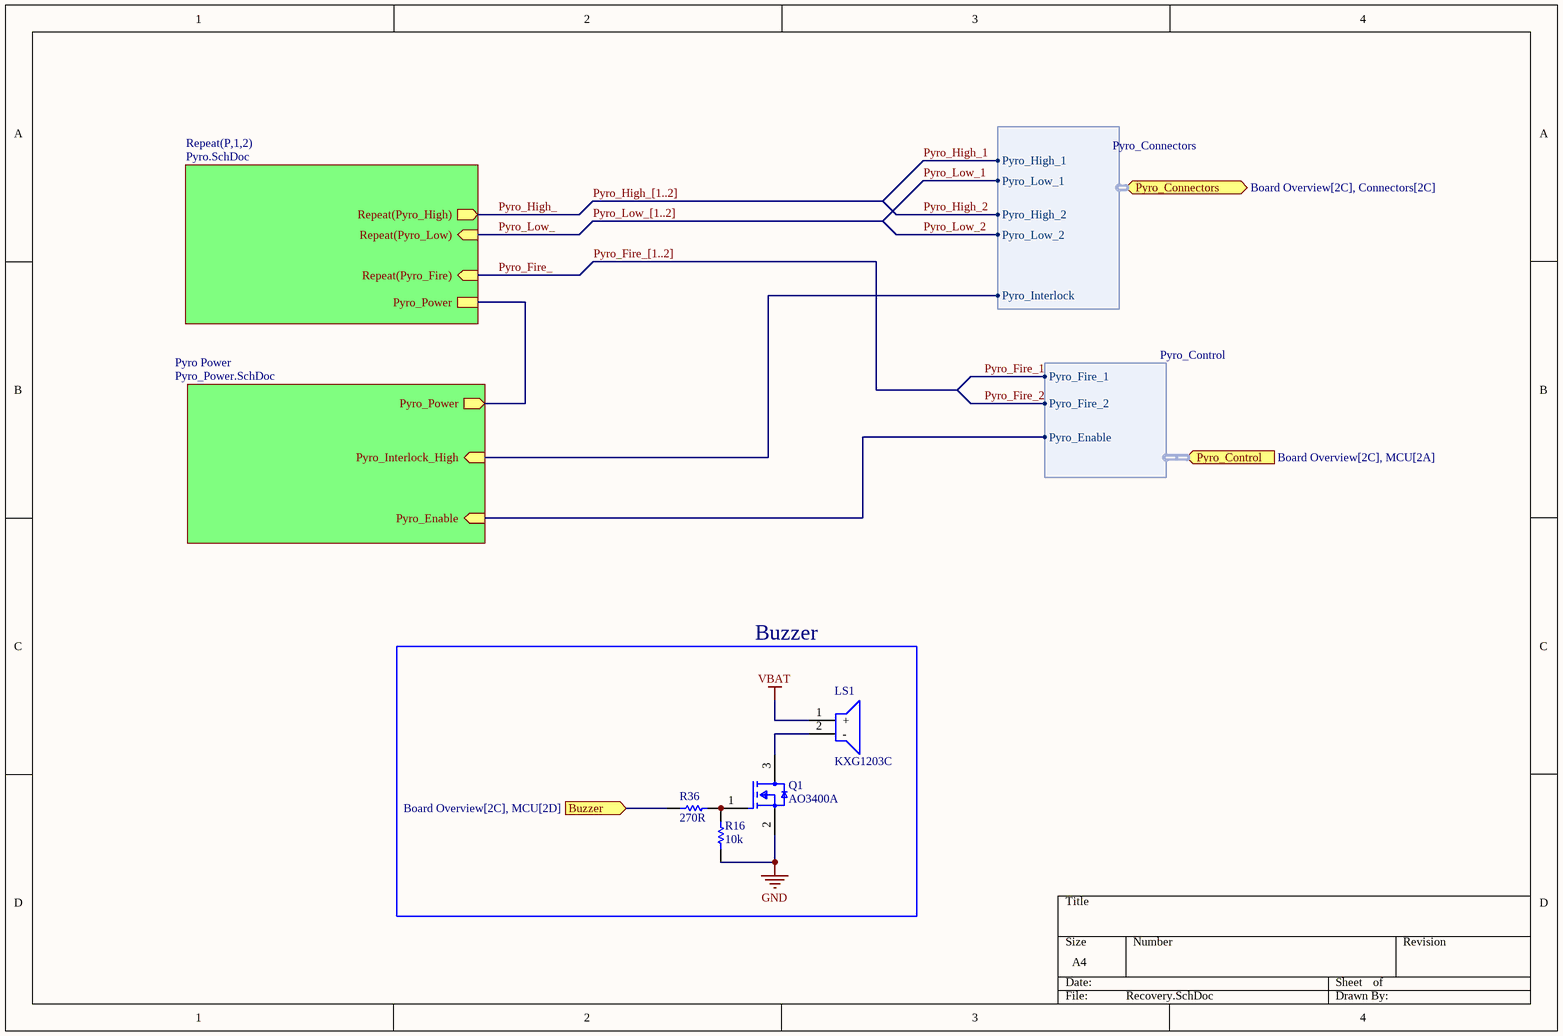
[diagram p7: Recovery.SchDoc]

### Parts
LS1  KXG1203C  [KXG1203C]
Q1  AO3400A  [FP-SOT23-IPC_C]
R16  value 10k  [RESC1609X50X30ML8T20]  (hidden comment: Generic-Resistor)
R36  value 270R  [RESC1609X50X30ML8T20]  (hidden comment: Generic-Resistor)

### Blocks framed on the sheet
Buzzer: LS1 Q1 R16 R36

### Sub-sheets
Pyro Power = Pyro_Power.SchDoc: Pyro_Interlock_High (in), Pyro_Enable (in), Pyro_Power (out)
Repeat(P,1,2) = Pyro.SchDoc: Repeat(Pyro_Fire) (in), Repeat(Pyro_High) (out), Repeat(Pyro_Low) (in), Pyro_Power

### Ports
Buzzer (in, see Board Overview[2C], MCU[2D]), Pyro_Connectors (bidir, harness Pyro_Connectors, see Board Overview[2C], Connectors[2C]), Pyro_Control (in, harness Pyro_Control, see Board Overview[2C], MCU[2A])

### Harnesses
Pyro_Control: Pyro_Fire_1, Pyro_Enable, Pyro_Fire_2
Pyro_Connectors: Pyro_High_1, Pyro_Low_1, Pyro_Interlock, Pyro_High_2, Pyro_Low_2

### Nets
GND: Q1.2(S) R16.1
VBAT: LS1.1(+)
Buzzer: R36.1 ; port Buzzer
Pyro_Enable: sheet Pyro Power/Pyro_Enable, port Pyro_Control.Pyro_Enable
Pyro_Fire_: sheet Repeat(P,1,2)/Repeat(Pyro_Fire)
Pyro_High_: sheet Repeat(P,1,2)/Repeat(Pyro_High)
Pyro_High_1: sheet Repeat(P,1,2)/Pyro_Power, sheet Pyro Power/Pyro_Power, port Pyro_Connectors.Pyro_High_1, port Pyro_Connectors.Pyro_High_2  [also labelled Pyro_High_2]
Pyro_Interlock_High: sheet Pyro Power/Pyro_Interlock_High, port Pyro_Connectors.Pyro_Interlock
Pyro_Low_: sheet Repeat(P,1,2)/Repeat(Pyro_Low)
NetLS1_2: LS1.2(-) Q1.3(D)
NetQ1_1: Q1.1(G) R16.2 R36.2

### Buses and harness runs
bus Pyro_Fire_[1..2]
bus Pyro_High_[1..2]
bus Pyro_Low_[1..2]

### Library data of the parts
LS1 = CMP-059-000000-1: Kingstate 5V dc PCB Mount Electromagnetic Buzzer; Source: SamacSys.SchLib; Design Item ID: KXG1203C; Manufacturer_Part_Number: KXG1203C; Datasheet Link: http://uk.rs-online.com/web/p/products/7716957P; RS Price/Stock: http://uk.rs-online.com/web/p/products/7716957P; Height: 9.5mm; Manufacturer_Name: KINGSTATE; RS Part Number: 7716957P
Q1 = CMP-013-00038-1: N沟道 VDS=30V VGS=±12V ID=5.7A P=1.4W; LCSC Part #: C20917
R16 R36 = CMP-009-00185-4: as R38 on sheet MCU; Case Code (Metric): 1608; Case Code (Imperial): 0603
  R16: LCSC Part #: C25804
  R36: LCSC Part #: C22966

## Sheet Pyro.SchDoc
size A4; SheetNumber: 4; SheetTotal: 10
Used 2 times, as channels Recovery/P1, Recovery/P2. Parts and nets are listed once, with the designators drawn on the sheet.
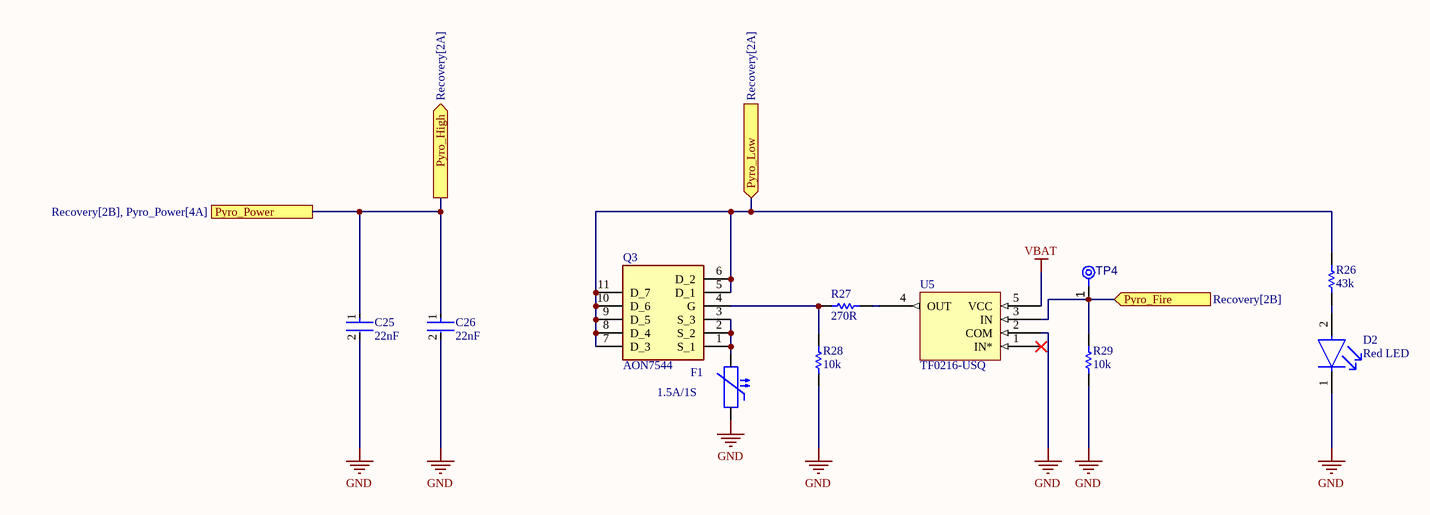
[diagram p8: Pyro.SchDoc]

### Parts
C25  value 22nF  [FP-0603-L_1_6_0_15-W_0_81-IPC_C]  (hidden comment: Generic-Capacitor)
C26  value 22nF  [FP-0603-L_1_6_0_15-W_0_81-IPC_C]  (hidden comment: Generic-Capacitor)
D2  Red LED  [FP-LTST-C190GKT-MFG]
F1  1.5A/1S  [RESC3115X65N]
Q3  AON7544  [AON7544]
R26  value 43k  [RESC1609X50X30ML8T20]  (hidden comment: Generic-Resistor)
R27  value 270R  [RESC1609X50X30ML8T20]  (hidden comment: Generic-Resistor)
R28  value 10k  [RESC1609X50X30ML8T20]  (hidden comment: Generic-Resistor)
R29  value 10k  [RESC1609X50X30ML8T20]  (hidden comment: Generic-Resistor)
TP4  TPAD6R  [TP06R]  (value not drawn)  (no BOM)
U5  TF0216-USQ  [SOT95P245X110-5N]

### Ports
Pyro_Fire (in, see Recovery[2B]), Pyro_High (out, see Recovery[2A]), Pyro_Low (in, see Recovery[2A]), Pyro_Power (see Recovery[2B], Pyro_Power[4A])

### Nets
GND: C25.2 C26.2 D2.1(C) F1.2 R28.1 R29.1 U5.2(COM)
VBAT: U5.5(VCC)
Pyro_Fire: R29.2 TP4.1(TP) U5.3(IN) ; port Pyro_Fire
Pyro_High: C25.1 C26.1 ; port Pyro_Power, port Pyro_High
Pyro_Low: Q3.5(D_1) Q3.6(D_2) Q3.7(D_3) Q3.8(D_4) Q3.9(D_5) Q3.10(D_6) Q3.11(D_7) R26.2 ; port Pyro_Low
NetD2_2: D2.2(A) R26.1
NetF1_1: F1.1 Q3.1(S_1) Q3.2(S_2) Q3.3(S_3)
NetQ3_4: Q3.4(G) R27.1 R28.2
NetR27_2: R27.2 U5.4(OUT)

Not connected (* = marked no-connect by the designer): U5 1(IN*)*

### Channels
Recovery/P1: designators end in _P1; ports Pyro_Fire=Pyro_Fire_1 Pyro_High=Pyro_High_1 Pyro_Low=Pyro_Low_1 Pyro_Power=Pyro_High_1
Recovery/P2: designators end in _P2; ports Pyro_Fire=Pyro_Fire_2 Pyro_High=Pyro_High_1 Pyro_Low=Pyro_Low_2 Pyro_Power=Pyro_High_1

### Library data of the parts
C25 C26 = CMP-001-00088-6: as C5 on sheet Power; LCSC Part #: C21122; Case Code (Imperial): 0603
D2 = CMP-00026-00001-1: SZYY0603R; LCSC PART #: C434419
F1 = ASMD1206-075-30V: Polymeric PTC Resettable Fuse 30V 0.75A Surface Mount 1206; ComponentLink1Description: Datasheet; ComponentLink1URL: https://datasheet.lcsc.com/lcsc/2204011730_Shenzhen-JDT-Fuse-ASMD1206-075-30V_C2982268.pdf; Unit Price: 0.0525
Q3 = CMP-089-000000-2: MOSFET N Trench 30V 30A(Tc) 2.2V @ 250uA 5 m @ 20A,10V DFN-8_3x3 EP RoHS; Manufacturer_Name: Alpha & Omega Semiconductors; Geometry.Height: 0.9mm; Arrow Part Number: *; Mouser Price/Stock: *; Datasheet Link: https://datasheet.lcsc.com/lcsc/1912111437_Alpha---Omega-Semicon-AON7544_C315567.pdf; Mouser Part Number: *; Source: AON7544.SchLib; Design Item ID: AON7544; Manufacturer_Part_Number: AON7544; Arrow Price/Stock: *; LCSC Part #: C315567
R26-R29 = CMP-009-00185-4: as R38 on sheet MCU; Case Code (Metric): 1608; Case Code (Imperial): 0603
  R26: LCSC Part #: C23172
  R27: LCSC Part #: C22966
  R28 R29: LCSC Part #: C25804
TP4 = CMP-00028-00002-2: 0.6mm round; Pins: 1
U5 = CMP-011-00013-1: High Speed, Low-Side, Single Gate Driver; LCSC Part #: C2683769

## Sheet Pyro_Power.SchDoc
size A4; SheetNumber: 5; SheetTotal: 10
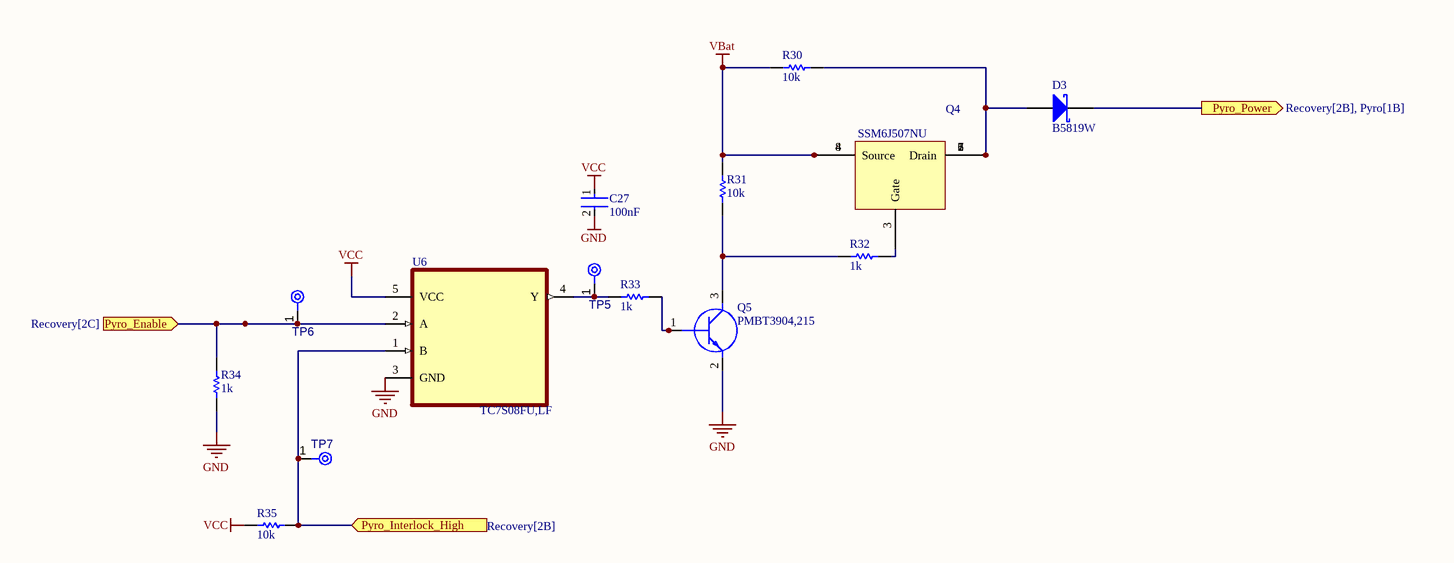
[diagram p9: Pyro_Power.SchDoc]

### Parts
C27  value 100nF  [FP-0603-L_1_6_0_15-W_0_81-IPC_C]  (hidden comment: Generic-Capacitor)
D3  B5819W  [MCC-SOD123_V]
Q4  SSM6J507NU  [SSM6J507NULF]
Q5  PMBT3904,215  [SOT95P230X110-3N]
R30  value 10k  [RESC1609X50X30ML8T20]  (hidden comment: Generic-Resistor)
R31  value 10k  [RESC1609X50X30ML8T20]  (hidden comment: Generic-Resistor)
R32  value 1k  [RESC1609X50X30ML8T20]  (hidden comment: Generic-Resistor)
R33  value 1k  [RESC1609X50X30ML8T20]  (hidden comment: Generic-Resistor)
R34  value 1k  [RESC1609X50X30ML8T20]  (hidden comment: Generic-Resistor)
R35  value 10k  [RESC1609X50X30ML8T20]  (hidden comment: Generic-Resistor)
TP5  TPAD6R  [TP06R]  (value not drawn)  (no BOM)
TP6  TPAD6R  [TP06R]  (value not drawn)  (no BOM)
TP7  TPAD6R  [TP06R]  (value not drawn)  (no BOM)
U6  TC7S08FU,LF  [SOT65P210X110-5N]

### Ports
Pyro_Enable (in, see Recovery[2C]), Pyro_Interlock_High (in, see Recovery[2B]), Pyro_Power (out, see Recovery[2B], Pyro[1B])

### Nets
GND: C27.2 Q5.2(E) R34.1 U6.3(GND)
VBAT: Q4.4(Source) Q4.8 R30.1 R31.2
VCC: C27.1 R35.1 U6.5(VCC)
Pyro_Enable: R34.2 TP6.1(TP) U6.2(A) ; port Pyro_Enable
Pyro_High_1: D3.2(K) ; port Pyro_Power
Pyro_Interlock_High: R35.2 TP7.1(TP) U6.1(B) ; port Pyro_Interlock_High
NetD3_1: D3.1(A) Q4.1(Drain) Q4.2 Q4.5 Q4.6 Q4.7 R30.2
NetQ4_3: Q4.3(Gate) R32.1
NetQ5_1: Q5.1(B) R33.1
NetQ5_3: Q5.3(C) R31.1 R32.2
NetR33_2: R33.2 TP5.1(TP) U6.4(Y)

### Library data of the parts
C27 = CMP-001-00088-6: as C5 on sheet Power; LCSC Part #: C14663; Case Code (Imperial): 0603
D3 = CMP-004-00005-3: Schottky Barrier Rectifier, 40 V, 1 A, -65 to 125 degC, 2-Pin SOD123, RoHS, Tape and Reel; Manufacturer: Micro Commercial Components; Datasheet Version: Rev. B, 01/2013; RoHS Compliant: Unknown; Manufacturer URL: http://www.mccsemi.com/; Package URL: http://www.mccsemi.com/up_pdf/1N4448W(SOD-123).pdf; Case/Package: SOD123; Mounting Technology: SM; Datasheet URL: http://www.mccsemi.com/up_pdf/B5817W-B5819W(SOD-123).pdf; Package Description: 2-Pin Small Outline Diode, Body 2.7 x 1.6 mm, Height 1.35 mm; Package Reference: SOD123; LCSC Part #: C8598
Q4 = CMP-013-000003-10: MOSFET Small Signal MOSFET V=30V; Manufacturer_Name: Toshiba; Manufacturer_Part_Number: SSM6J507NU,LF; Datasheet Link: https://toshiba.semicon-storage.com/info/SSM6J507NU_datasheet_en_20151110.pdf?did=30372&prodName=SSM6J507NU; Mouser Price/Stock: https://www.mouser.co.uk/ProductDetail/Toshiba/SSM6J507NULF?qs=YeFsEeYZIJmLsTAyWirtAw%3D%3D; Mouser Part Number: 757-SSM6J507NULF; Height: 0.8mm; Design Item ID: SSM6J507NU,LF; Source: SamacSys.SchLib; LCSC Part #: C146318
Q5 = CMP-013-000004-1: PMBT3904 - NPN switching transistor; Manufacturer_Name: Nexperia; Arrow Price/Stock: https://www.arrow.com/en/products/pmbt3904215/nexperia?region=europe; Design Item ID: PMBT3904,215; Datasheet Link: https://assets.nexperia.com/documents/data-sheet/PMBT3904.pdf; Manufacturer_Part_Number: PMBT3904,215; Arrow Part Number: PMBT3904,215; Mouser Part Number: 771-PMBT3904-T/R; Source: SamacSys.SchLib; Mouser Price/Stock: https://www.mouser.co.uk/ProductDetail/Nexperia/PMBT3904215?qs=LOCUfHb8d9tXximHEgx1nw%3D%3D; Height: 1.1mm; LCSC Part #: C8667
R30-R35 = CMP-009-00185-4: as R38 on sheet MCU; Case Code (Metric): 1608; Case Code (Imperial): 0603
  R30 R31 R35: LCSC Part #: C25804
  R32-R34: LCSC Part #: C21190
TP5-TP7 = CMP-00028-00002-2: 0.6mm round; Pins: 1
U6 = CMP-064-000000-3: Single 2-input AND gate; MP: TC7S08FU,LF; Package: None; Price: None; Availability: Unavailable; Value: *; Pin Count: 5; Component Type: Standard; Design Item ID: TC7S08FU,LF; LCSC Part #: C146362

## Nets that join several sheets
5V: Power (D1.1), Connectors (J5.A4 J5.A9 J5.B4 J5.B9)
BatReg_IN: Power (B1.8 C32.2 D4.2), Connectors (J3.1 J3.2)
GND: Power (9 pins), MCU (31 pins), Storage (8 pins), Connectors (23 pins), Radio (7 pins), Sensors (15 pins), Recovery (Q1.2 R16.1), Recovery/P1 (7 pins), Recovery/P2 (7 pins), Pyro_Power (C27.2 Q5.2 R34.1 U6.3)
VBAT: Power (6 pins), Recovery (LS1.1), Recovery/P1 (U5_P1.5), Recovery/P2 (U5_P2.5), Pyro_Power (Q4.4 Q4.8 R30.1 R31.2)
VCC: Power (6 pins), MCU (21 pins), Storage (9 pins), Connectors (7 pins), Radio (U2.13), Sensors (16 pins), Pyro_Power (C27.1 R35.1 U6.5)
Bat_+: Power (7 pins), Connectors (J4.9 J4.10)
BUSY: MCU (U1.34), Radio (U2.16)
Buzzer: MCU (U1.98), Recovery (R36.1)
DIO1: MCU (U1.33), Radio (U2.15)
Flash CLK: MCU (U1.36), Storage (U4.6)
Flash IO 0: MCU (U1.58), Storage (U4.5)
Flash IO 1: MCU (U1.59), Storage (U4.2)
Flash IO 2: MCU (U1.2), Storage (U4.3)
Flash IO 3: MCU (U1.24), Storage (U4.7)
Flash NCS: MCU (U1.92), Storage (R13.1 U4.1)
GPIO1: MCU (U1.41), Connectors (J3.5)
GPIO2: MCU (U1.42), Connectors (J3.4)
GPIO3: MCU (U1.43), Connectors (J3.3)
GPS_LED: MCU (U12.1), Connectors (J1.2)
GPS_RX: MCU (U1.77), Connectors (J1.4)
GPS_TX: MCU (U1.69), Connectors (J1.3)
I2C1_SCL: MCU (U1.95), Sensors (R10.2 U8.2)
I2C1_SDA: MCU (U1.96), Sensors (R9.2 U8.4)
I2C2_SCL: MCU (U1.47), Sensors (R12.2 U7.19)
I2C2_SDA: MCU (U1.89), Sensors (R11.2 U7.20)
I2C3_SCL: MCU (U1.67), Connectors (J2.3 R39.2)
I2C3_SDA: MCU (U1.90), Connectors (J2.2 R40.2)
IMU_INT: MCU (U1.46), Sensors (U7.14)
MainSwitch_Low: Power (R15.2 U3.2), Connectors (J4.3 J4.4)
MISO: MCU (U1.31), Radio (U2.2)
MOSI: MCU (U1.32), Radio (U2.3)
MPU_NRST: MCU (5 pins), Connectors (J8.10)
NRESET: MCU (U1.35), Radio (U2.6)
NSS: MCU (U1.29), Radio (U2.5)
PSENS_INT: MCU (U1.97), Sensors (U8.7)
Pyro_Enable: MCU (U1.88), Pyro_Power (R34.2 TP6.1 U6.2)
Pyro_Fire_1: MCU (U1.86), Recovery/P1 (R29_P1.2 TP4_P1.1 U5_P1.3)
Pyro_Fire_2: MCU (U1.87), Recovery/P2 (R29_P2.2 TP4_P2.1 U5_P2.3)
Pyro_High_1: Connectors (J6.3 J6.4 J6.5 J6.6), Recovery/P1 (C25_P1.1 C26_P1.1), Recovery/P2 (C25_P2.1 C26_P2.1), Pyro_Power (D3.2)
Pyro_Interlock_High: Connectors (J6.9 J6.10), Pyro_Power (R35.2 TP7.1 U6.1)
Pyro_Low_1: Connectors (J6.1 J6.2), Recovery/P1 (8 pins)
Pyro_Low_2: Connectors (J6.7 J6.8), Recovery/P2 (8 pins)
SCK: MCU (U1.30), Radio (U2.4)
SD_Detect: MCU (U1.53), Storage (SD1.9)
SDIO_CK: MCU (U1.54), Storage (SD1.5)
SDIO_CM: MCU (U1.83), Storage (R23.1 SD1.3)
SDIO_D0: MCU (U1.65), Storage (R22.1 SD1.7)
SDIO_D1: MCU (U1.66), Storage (R21.1 SD1.8)
SDIO_D2: MCU (U1.78), Storage (R25.1 SD1.1)
SDIO_D3: MCU (U1.79), Storage (R24.1 SD1.2)
Solar_ADC1: MCU (U1.15), Connectors (J2.4)
SPI2_MISO: MCU (U1.17), Connectors (J2.5)
SPI2_MOSI: MCU (U1.18), Connectors (J2.6)
SPI2_SCK: MCU (U1.52), Connectors (J2.7)
SWCLK: MCU (U1.76), Connectors (J8.4)
SWIO: MCU (U1.72), Connectors (J8.2)
UART2_RX: MCU (U1.26), Connectors (J3.7)
UART2_TX: MCU (U1.25), Connectors (J3.6)
Umbilical_high: Power (D4.1), Connectors (J4.5 J4.6)
USB_Data_N: MCU (U1.70), Connectors (J5.A7 J5.B7)
USB_Data_P: MCU (U1.71), Connectors (J5.A6 J5.B6)